# Altium project PPC_notebook_electrical_schematics_v0.7.PrjPcb (part 10 of 14)

## Sheet 22 MXM_VIDEO_OUT.SchDoc
size 420 x 297 mm
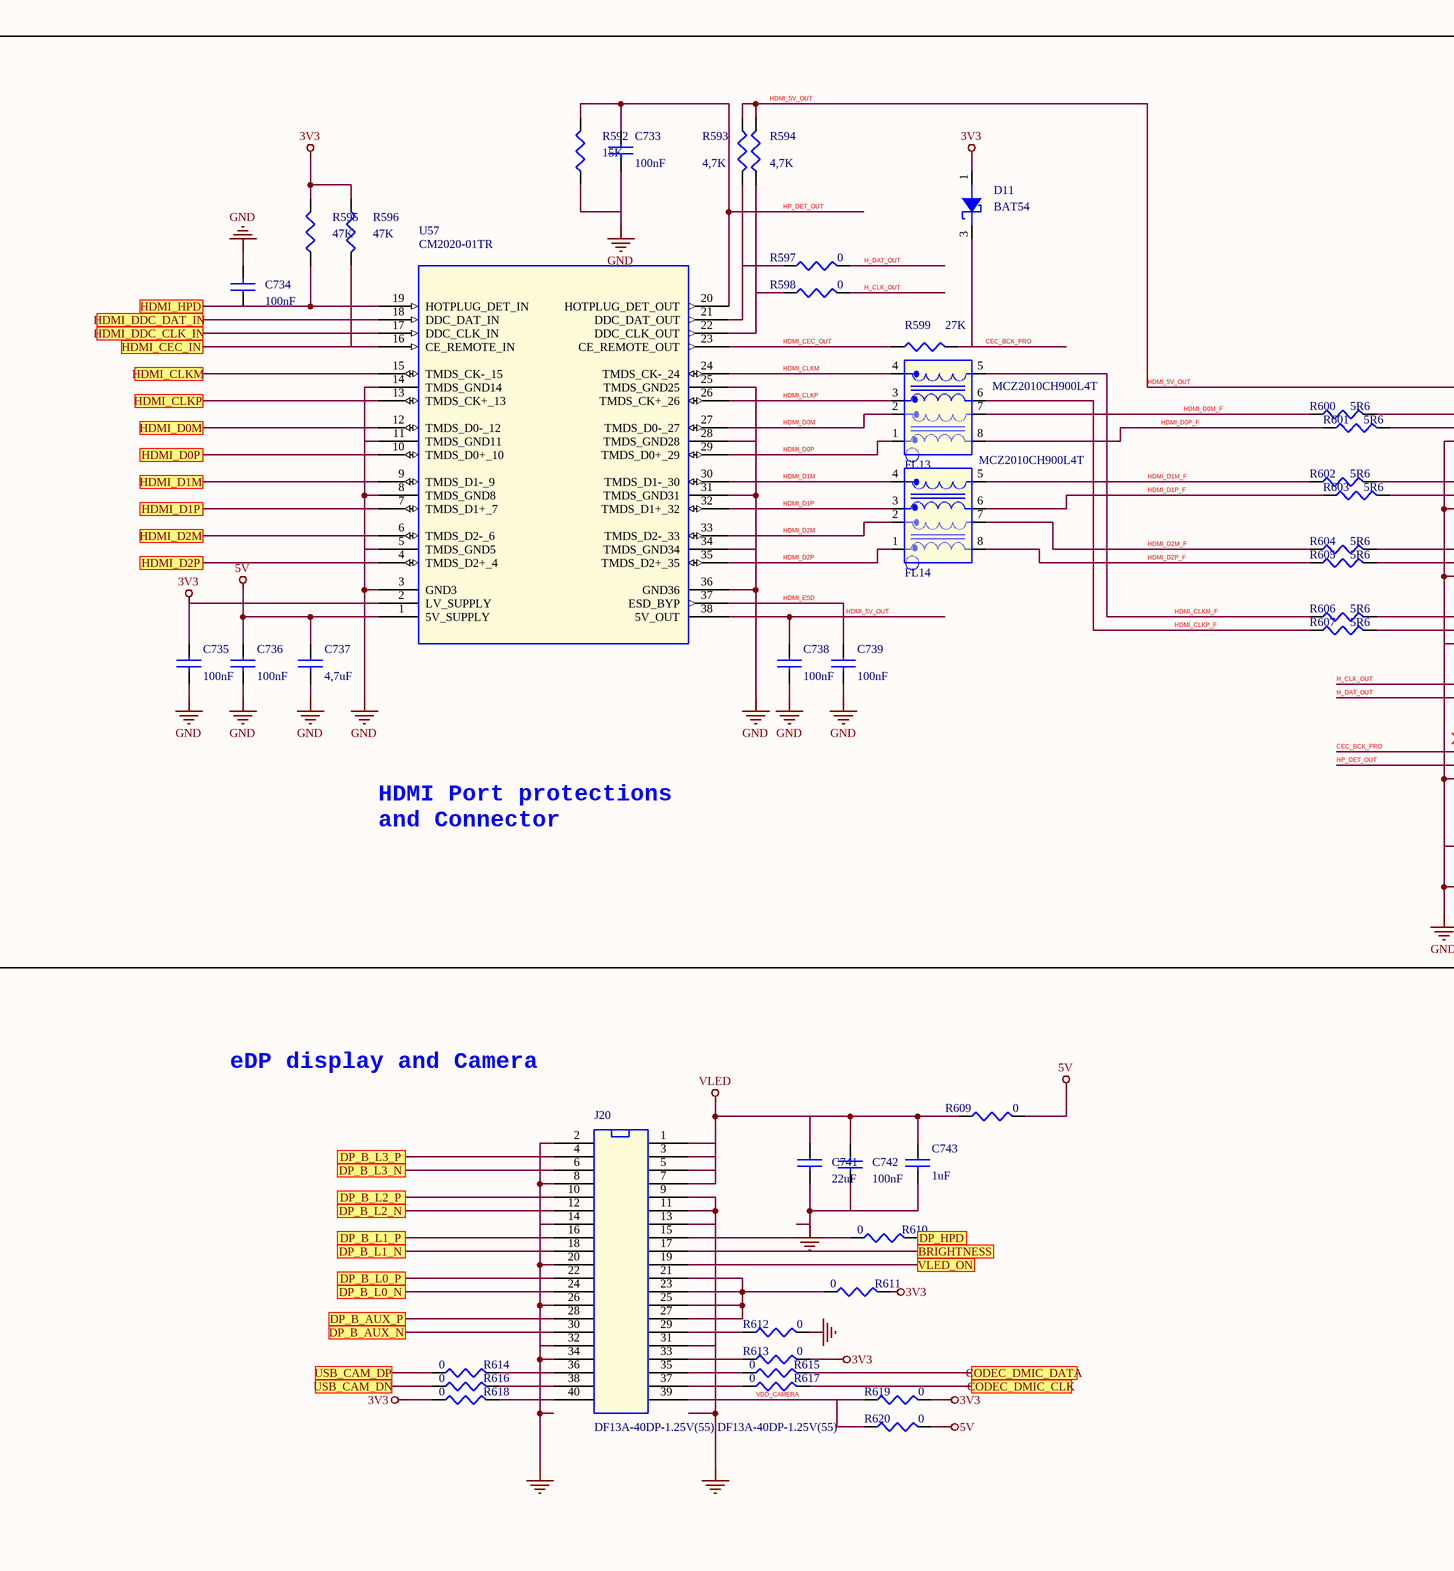
[diagram p50: 22 MXM_VIDEO_OUT.SchDoc, left]
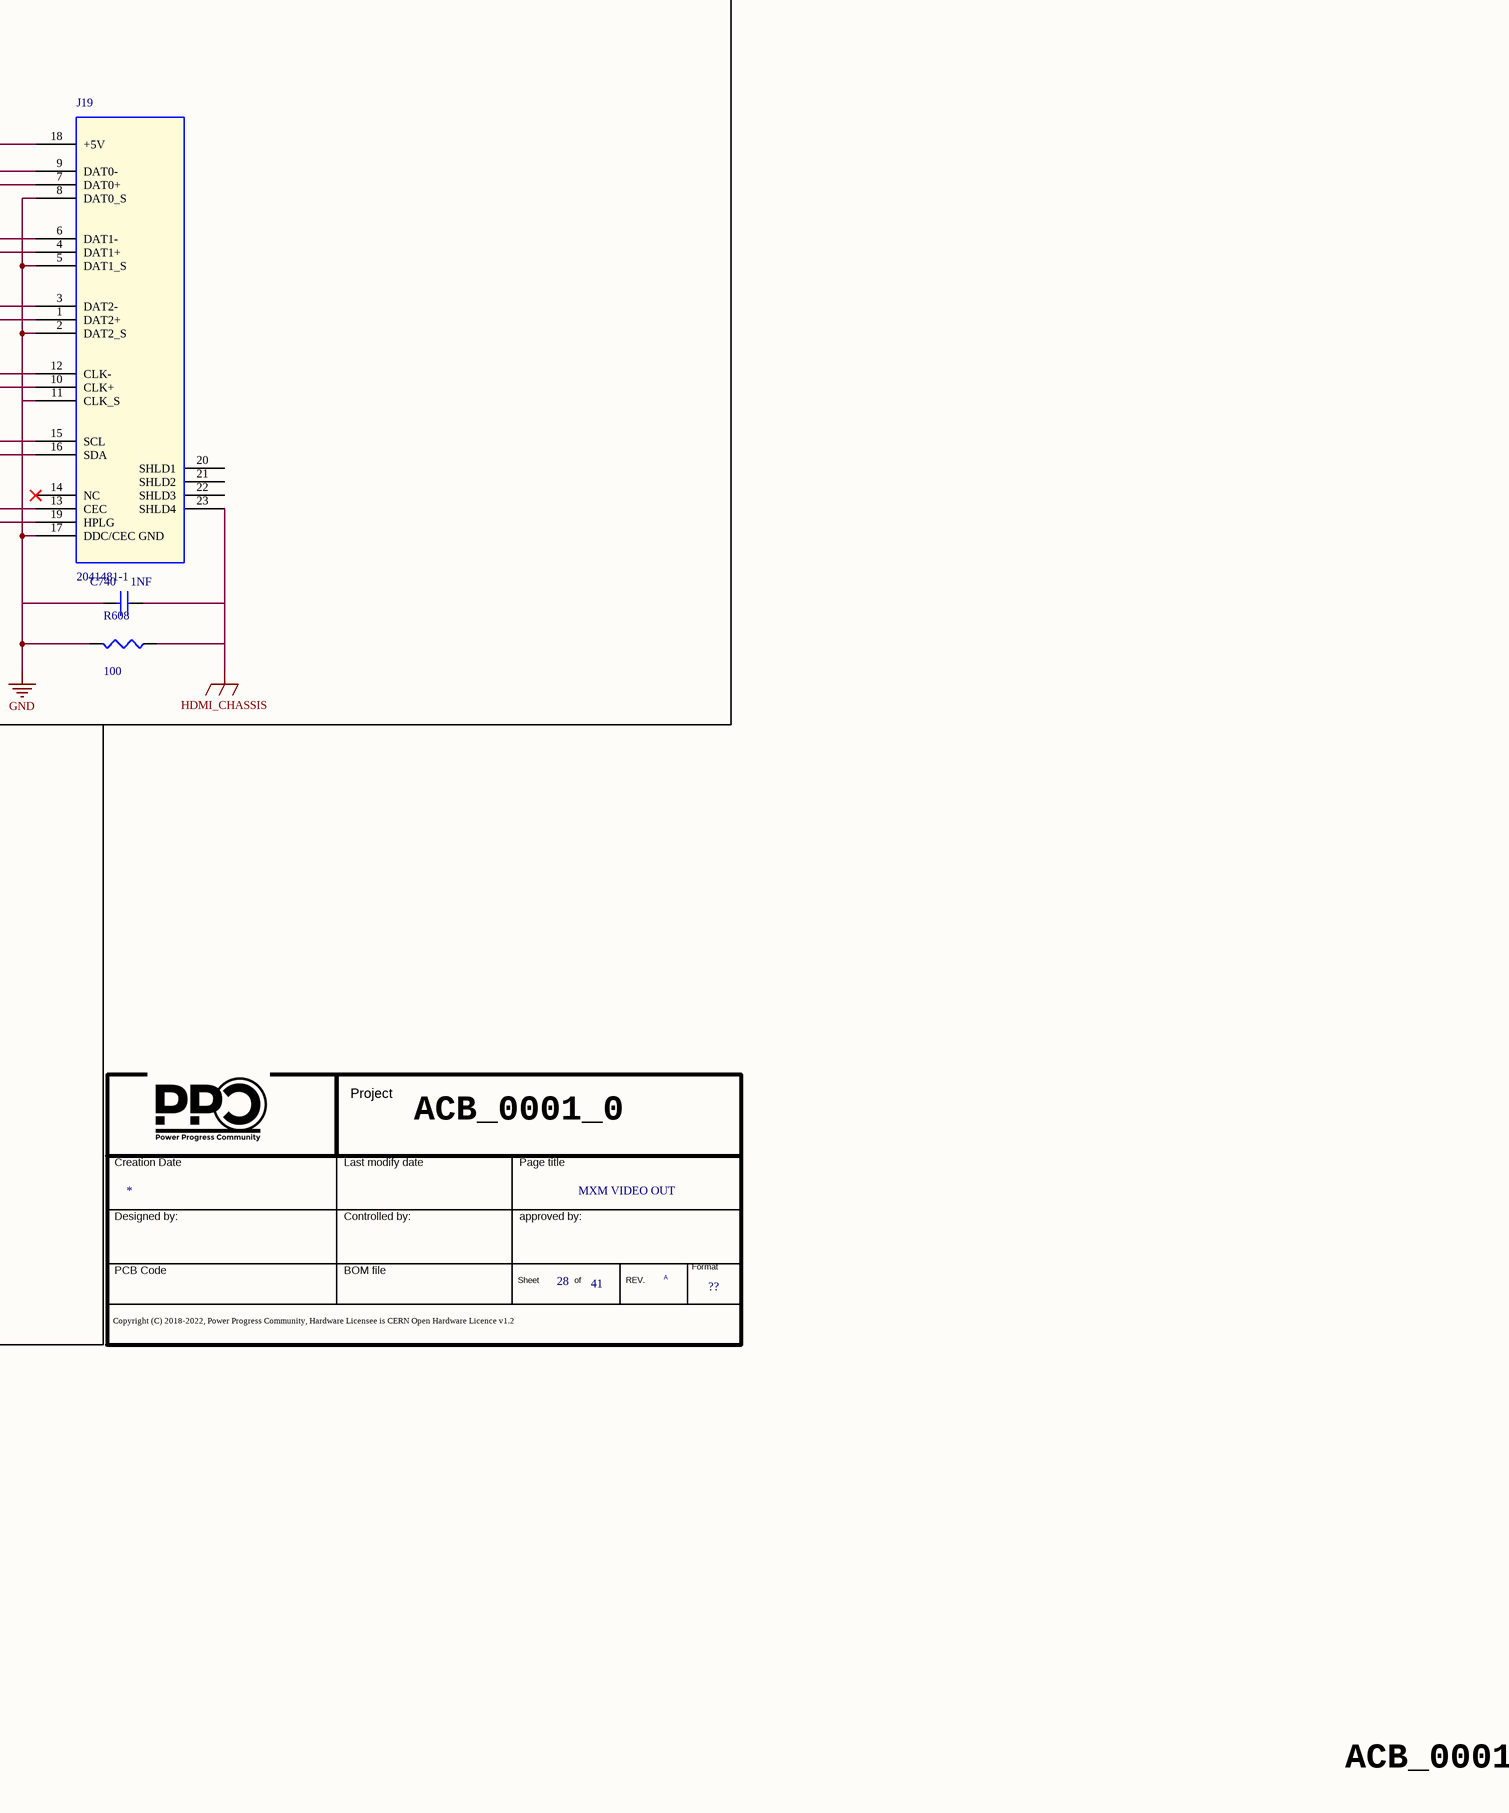
[diagram p51: 22 MXM_VIDEO_OUT.SchDoc, right]

### Parts
(Parts that share a designator on the sheet are numbered #1, #2 ... from top to bottom, then left to right.)
*#31  Doc: MXM VIDEO OUT  Page Count: 41  Page Number: 28  Page Size: ??  RevCode: A  (hidden comment: Title_block_PPC)  (graphical)
C733  100nF  [SMD_0402]
C734  100nF  [SMD_0402]
C735  100nF  [SMD_0402]
C736  100nF  [SMD_0402]
C737  4,7uF  [SMD_0603]
C738  100nF  [SMD_0402]
C739  100nF  [SMD_0402]
C740  1NF  [SMD_1808]
C741  22uF  [SMD_0805]
C742  100nF  [SMD_0402]
C743  1uF  [SMD_0402]
D11  BAT54  [SOT-23]
FL13  MCZ2010CH900L4T  [SMD]
FL14  MCZ2010CH900L4T  [SMD]
J19  2041481-1  [19 PIN SMD]
J20  DF13A-40DP-1.25V(55) / DF13A-40DP-1.25V(55)  [SMD_2X50_P=0.635mm]
R592  15K  [SMD_0402]
R593  4,7K  [SMD_0402]
R594  4,7K  [SMD_0402]
R595  47K  [SMD_0402]
R596  47K  [SMD_0402]
R597  0  [SMD_0402]
R598  0  [SMD_0402]
R599  27K  [SMD_0402]
R600  5R6  [SMD_0402]
R601  5R6  [SMD_0402]
R602  5R6  [SMD_0402]
R603  5R6  [SMD_0402]
R604  5R6  [SMD_0402]
R605  5R6  [SMD_0402]
R606  5R6  [SMD_0402]
R607  5R6  [SMD_0402]
R608  100  [SMD_0402]
R609  0  [SMD_1206]
R610  0  [SMD_0402]
R611  0  [SMD_0402]
R612  0  [SMD_0402]
R613  0  [SMD_0402]
R614  0  [SMD_0402]
R615  0  [SMD_0402]
R616  0  [SMD_0402]
R617  0  [SMD_0402]
R618  0  [SMD_0402]
R619  0  [SMD_0402]
R620  0  [SMD_0402]
U57  CM2020-01TR  [tssop38]

### Blocks framed on the sheet
eDP display and Camera: C741-C743 J20 R609-R620

### Ports
BRIGHTNESS, CODEC_DMIC_CLK, CODEC_DMIC_DATA, DP_B_AUX_N, DP_B_AUX_P, DP_B_L0_N, DP_B_L0_P, DP_B_L1_N, DP_B_L1_P, DP_B_L2_N, DP_B_L2_P, DP_B_L3_N, DP_B_L3_P, DP_HPD, HDMI_CEC_IN, HDMI_CLKM, HDMI_CLKP, HDMI_D0M, HDMI_D0P, HDMI_D1M, HDMI_D1P, HDMI_D2M, HDMI_D2P, HDMI_DDC_CLK_IN, HDMI_DDC_DAT_IN, HDMI_HPD, USB_CAM_DN, USB_CAM_DP, VLED_ON

### Nets
3V3: C735.1 D11.1(ANODE) R595.1 R596.1 R611.1 R613.2 R618.2 R619.2 U57.2(LV_SUPPLY)
5V: C736.1 C737.1 R609.2 R620.2 U57.1(5V_SUPPLY)
GND: C733.2 C734.2 C735.2 C736.2 C737.2 C738.2 C739.2 C740.2 C741.2 C742.1 C743.2 J19.2(DAT2_S) J19.5(DAT1_S) J19.8(DAT0_S) J19.11(CLK_S) J19.17(DDC/CEC_GND) J20.2 J20.8 J20.9 J20.11 J20.13 J20.14 J20.20 J20.26 J20.31 J20.32 J20.34 R592.2 R608.2 R612.2 U57.3(GND3) U57.5(TMDS_GND5) U57.8(TMDS_GND8) U57.11(TMDS_GND11) U57.14(TMDS_GND14) U57.25(TMDS_GND25) U57.28(TMDS_GND28) U57.31(TMDS_GND31) U57.34(TMDS_GND34) U57.36(GND36)
HDMI_CHASSIS: C740.1 J19.23(SHLD4) R608.1
VLED: C741.1 C742.2 C743.1 J20.1 J20.3 J20.5 J20.7 R609.1
CEC_BCK_PRO: D11.3(CATHODE) J19.13(CEC) R599.2
H_CLK_OUT: J19.15(SCL) R598.2
H_DAT_OUT: J19.16(SDA) R597.2
HDMI_5V_OUT: C738.1 J19.18(+5V) R593.2 R594.2 U57.38(5V_OUT)
HDMI_CEC_OUT: R599.1 U57.23(CE_REMOTE_OUT)
HDMI_CLKM: FL13.4 U57.24(TMDS_CK-_24)
HDMI_CLKM_F: FL13.5 R606.1
HDMI_CLKP: FL13.3 U57.26(TMDS_CK+_26)
HDMI_CLKP_F: FL13.6 R607.1
HDMI_D0M: FL13.2 U57.27(TMDS_D0-_27)
HDMI_D0M_F: FL13.7 R600.1
HDMI_D0P: FL13.1 U57.29(TMDS_D0+_29)
HDMI_D0P_F: FL13.8 R601.1
HDMI_D1M: FL14.4 U57.30(TMDS_D1-_30)
HDMI_D1M_F: FL14.5 R602.1
HDMI_D1P: FL14.3 U57.32(TMDS_D1+_32)
HDMI_D1P_F: FL14.6 R603.1
HDMI_D2M: FL14.2 U57.33(TMDS_D2-_33)
HDMI_D2M_F: FL14.7 R604.1
HDMI_D2P: FL14.1 U57.35(TMDS_D2+_35)
HDMI_D2P_F: FL14.8 R605.1
HDMI_ESD: C739.1 U57.37(ESD_BYP)
HP_DET_OUT: C733.1 J19.19(HPLG) R592.1 U57.20(HOTPLUG_DET_OUT)
VDD_CAMERA: J20.39 R619.1 R620.1
NetC715_2: J20.24 ; port DP_B_L0_N
NetC716_2: J20.22 ; port DP_B_L0_P
NetC717_2: J20.18 ; port DP_B_L1_N
NetC718_2: J20.16 ; port DP_B_L1_P
NetC719_2: U57.12(TMDS_D0-_12) ; port HDMI_D0M
NetC720_2: U57.10(TMDS_D0+_10) ; port HDMI_D0P
NetC721_2: J20.12 ; port DP_B_L2_N
NetC722_2: J20.10 ; port DP_B_L2_P
NetC723_2: U57.9(TMDS_D1-_9) ; port HDMI_D1M
NetC724_2: U57.7(TMDS_D1+_7) ; port HDMI_D1P
NetC725_2: J20.6 ; port DP_B_L3_N
NetC726_2: J20.4 ; port DP_B_L3_P
NetC727_2: U57.6(TMDS_D2-_6) ; port HDMI_D2M
NetC728_2: U57.4(TMDS_D2+_4) ; port HDMI_D2P
NetC729_2: J20.30 ; port DP_B_AUX_N
NetC730_2: J20.28 ; port DP_B_AUX_P
NetC731_2: U57.15(TMDS_CK-_15) ; port HDMI_CLKM
NetC732_2: U57.13(TMDS_CK+_13) ; port HDMI_CLKP
NetC734_1: C734.1 R595.2 U57.19(HOTPLUG_DET_IN) ; port HDMI_HPD
NetJ18_29: R596.2 U57.16(CE_REMOTE_IN) ; port HDMI_CEC_IN
NetJ18_274: R610.1 ; port DP_HPD
NetJ18_277: U57.18(DDC_DAT_IN) ; port HDMI_DDC_DAT_IN
NetJ18_279: U57.17(DDC_CLK_IN) ; port HDMI_DDC_CLK_IN
NetJ19_1: J19.1(DAT2+) R605.2
NetJ19_3: J19.3(DAT2-) R604.2
NetJ19_4: J19.4(DAT1+) R603.2
NetJ19_6: J19.6(DAT1-) R602.2
NetJ19_7: J19.7(DAT0+) R601.2
NetJ19_9: J19.9(DAT0-) R600.2
NetJ19_10: J19.10(CLK+) R607.2
NetJ19_12: J19.12(CLK-) R606.2
NetJ20_15: J20.15 R610.2
NetJ20_17: J20.17 ; port BRIGHTNESS
NetJ20_19: J20.19 ; port VLED_ON
NetJ20_21: J20.21 J20.23 J20.25 J20.27 R611.2
NetJ20_29: J20.29 R612.1
NetJ20_33: J20.33 R613.1
NetJ20_35: J20.35 R615.2
NetJ20_36: J20.36 R614.1
NetJ20_37: J20.37 R617.2
NetJ20_38: J20.38 R616.1
NetJ20_40: J20.40 R618.1
NetR297_2: R614.2 ; port USB_CAM_DP
NetR300_2: R616.2 ; port USB_CAM_DN
NetR593_1: R593.1 R597.1 U57.21(DDC_DAT_OUT)
NetR594_1: R594.1 R598.1 U57.22(DDC_CLK_OUT)
NetR615_1: R615.1 ; port CODEC_DMIC_DATA
NetR617_1: R617.1 ; port CODEC_DMIC_CLK

Not connected (* = marked no-connect by the designer): J19 14(NC)* 20(SHLD1) 21(SHLD2) 22(SHLD3)

### Notes on the sheet
- HDMI Port protections
  and Connector
- ACB_0001_0

### Library data of the parts
*#31 = Title_block_PPC: Title: T2080PCIe; Author: MICETEK; Page Create Date: March  8, 1995; Page Title: ?; Page Modify Date: *
C733-C735 = CAP NP_Dup6: COND.CER. 100NF 50V 0402 X7R SMD; Part Number: PASSIVE_24; Manufacturer 1: TDK; Manufacturer Part Number 1: CGA2B3X7R1H104M050BD; TECNO77: C0402; RSM: RC0402; Part Type: Capacitors\Ceramic\SMD\0402; Distributor 1: MURATA ELETTRONICA SPA; PCB Footprint: SMD_0402
C736 = CAP NP_Dup6: COND.CER. 100NF 50V 0402 X7R SMD; Manufacturer Part Number 1: CGA2B3X7R1H104M050BD; Manufacturer 1: TDK; Part Number: PASSIVE_24; TECNO77: C0402; RSM: RC0402; Distributor 1: MURATA ELETTRONICA SPA; Part Type: Capacitors\Ceramic\SMD\0402; PCB Footprint: SMD_0402
C737 = CAP NP_Dup6: COND.CER.4,7uF 16V X5R 0603 SMD; Part Number: PASSIVE_1405; Manufacturer 1: SAMSUNG; Manufacturer Part Number 1: CL10A475KO8NNNC; TECNO77: C0603; RSM: RC0603; Part Type: Capacitors\Ceramic\SMD\0603; Distributor 1: DIGIKEY (490-3302-1-ND); PCB Footprint: SMD_0603
C738 = CAP NP_Dup6: COND.CER. 100NF 50V 0402 X7R SMD; Part Number: PASSIVE_24; Manufacturer 1: TDK; Manufacturer Part Number 1: CGA2B3X7R1H104M050BD; RSM: RC0402; TECNO77: C0402; PCB Footprint: SMD_0402; Part Type: Capacitors\Ceramic\SMD\0402; Distributor 1: MURATA ELETTRONICA SPA
C739 = CAP NP_Dup6: COND.CER. 100NF 50V 0402 X7R SMD; Manufacturer Part Number 1: CGA2B3X7R1H104M050BD; Manufacturer 1: TDK; Part Number: PASSIVE_24; RSM: RC0402; TECNO77: C0402; PCB Footprint: SMD_0402; Distributor 1: MURATA ELETTRONICA SPA; Part Type: Capacitors\Ceramic\SMD\0402
C740 = CAP NP_Dup6: CAP CER 1000PF 2KV 20% X7R 1808; Manufacturer Part Number 1: 1808GC102MAT1A; Manufacturer 1: AVX; Part Number: PASSIVE_280; RSM: RC1808; TECNO77: C1210; PCB Footprint: SMD_1808; Distributor 1: DIGIKEY(709-1040-1-ND); Part Type: Capacitors\Ceramic\SMD\1808
C741 = CAP NP_Dup3: 22UF 35V 20% 0805; Manufacturer Part Number 1: C2012X5R1V226M125AC; Manufacturer 1: TDK; Part Number: PASSIVE_224; RSM: RC0805; PCB Footprint: SMD_0805; Part Type: Capacitors\Ceramic\SMD\0805
C742 = CAP NP_Dup10: COND.CER. 100NF 50V 0402 X7R SMD; Manufacturer Part Number 1: CGA2B3X7R1H104M050BD; Manufacturer 1: TDK; Part Number: PASSIVE_24; RSM: RC0402; Distributor 1: MURATA ELETTRONICA SPA; Part Type: Capacitors\Ceramic\SMD\0402; PCB Footprint: SMD_0402
C743 = CAP NP_Dup10: CAP CER 1UF 6.3V 10% X5R 0402 AUTOMOTIVE; Part Number: PASSIVE_49; Manufacturer 1: Taiyo Yuden; Manufacturer Part Number 1: JMK105BJ105KVHF; RSM: RC0402; Part Type: Capacitors\Ceramic\SMD\0402; Distributor 1: DIGIKEY (587-3766-1-ND); PCB Footprint: SMD_0402
D11 = diode_schottky_SOT23_Dup1: DIODE SCHOTTKY 30V 200MA SOT-23; Part Number: DISCRETE_84; Manufacturer 1: ZETEX; TECNO77: SOT23_P321; Part Type: Diodes\SCHOTTKY; Manufacturer Part Number 1: BAT54; Distributor 1: FARNELL (1467516); PCB Footprint: SOT-23; RSM: SOT-23
FL13 FL14 = CHOKE_HS_DUAL: CHOKE COMM MODE 90 OHM SMD HDMI; Part Number: PASSIVE_353; Manufacturer 1: TDK; RSM: EMI-MCZ2010CH; PCB Footprint: SMD; Part Type: Inductors\SMD\CM Choke; Manufacturer Part Number 1: MCZ2010CH900L4T
J19 = CONN_HDMI: HDMI TYPE A RECEPT RA SMD OFFSET CONN; Manufacturer 1: TE; Part Number: CONNECTORS_706; RSM: TE-HDMI-571-2041481-1; PCB Footprint: 19 PIN SMD; Distributor 1: MOUSER (571-2041481-1); Manufacturer Part Number 1: 2041481-1; Part Type: VPORT\HDMI
J20 = HEADER_20X2: Terminali e capicorda 1.25MM V PIN HEADER 40P SMT; PART NUMBER: CONNECTORS_135; Manufacturer 1: HIROSE; RSM: HIROSE-DF13A-40DP-1_25; PCB Footprint: SMD 2X20 P_125MM; Distributor 1: DIGIKEY(H10166-ND); Manufacturer Part Number 1: DF13A-40DP-1.25V(55) / DF13A-40DP-1.25V(55); Part Type: DF13
R592 = R_Dup6: RESIS.CHIP 15K 1% 0402 SMD; Manufacturer 1: ROYAL OHM; Part Number: PASSIVE_614; RSM: RC0402; Manufacturer Part Number 1: RESIS.CHIP 15K 1% 0402 SMD; PCB Footprint: SMD_0402; Part Type: Resistors\Fixed\SMD\0402\1%
R593 R594 = R_Dup8: RESIS.CHIP 4,7K 5% 0402 SMD; Manufacturer 1: ROYAL OHM; Part Number: PASSIVE_861; TECNO77: R0402; RSM: RC0402; Distributor 1: CAMEL ELETTRONICA SRL  #; Manufacturer Part Number 1: RESIS.CHIP 4,7K 5% 0402 SMD; Part Type: Resistors\Fixed\SMD\0402\5%; PCB Footprint: SMD_0402
R595 R596 = R_Dup6: RESIS.CHIP 47K 1% 0402 SMD; Part Number: PASSIVE_737; Manufacturer 1: ROYAL OHM; RSM: RC0402; Part Type: Resistors\Fixed\SMD\0402\1%; PCB Footprint: SMD_0402; Manufacturer Part Number 1: RESIS.CHIP 47K 1% 0402 SMD
R597 R598 = R_Dup8: RESIS.CHIP 0R 5% 0402 SMD; Manufacturer 1: ROYAL OHM; Part Number: PASSIVE_805; TECNO77: R0402; RSM: RC0402; Distributor 1: CAMEL ELETTRONICA SRL  #; Manufacturer Part Number 1: RESIS.CHIP 0R 5% 0402 SMD; Part Type: Resistors\Fixed\SMD\0402\5%; PCB Footprint: SMD_0402
R599 = R_Dup8: RESIS.CHIP 27K 1% 0402 SMD; Manufacturer 1: ROYAL OHM; Part Number: PASSIVE_664; RSM: RC0402; TECNO77: R0402; Distributor 1: CAMEL ELETTRONICA SRL  #; Manufacturer Part Number 1: RESIS.CHIP 27K 1% 0402 SMD; Part Type: Resistors\Fixed\SMD\0402\1%; PCB Footprint: SMD_0402
R600 R601 R605 = R_Dup6: RESIS.CHIP 5.6 ohm 5% 0402 SMD; Part Number: PASSIVE_1423; Manufacturer 1: YAGEO; Manufacturer Part Number 1: RC0402JR-075R6L; RSM: RC0402; Part Type: Resistors\Fixed\SMD\0402\5%; Distributor 1: DIGIKEY(311-5.6JRDKR-ND); PCB Footprint: SMD_0402
R602-R604 R606 R607 = R_Dup6: RESIS.CHIP 5.6 ohm 5% 0402 SMD; Manufacturer Part Number 1: RC0402JR-075R6L; Manufacturer 1: YAGEO; Part Number: PASSIVE_1423; RSM: RC0402; Distributor 1: DIGIKEY(311-5.6JRDKR-ND); Part Type: Resistors\Fixed\SMD\0402\5%; PCB Footprint: SMD_0402
R608 = R_Dup6: RESIS.CHIP 100R 5% 0402 SMD; Manufacturer 1: ROYAL OHM; Part Number: PASSIVE_812; RSM: RC0402; Manufacturer Part Number 1: RESIS.CHIP 100R 5% 0402 SMD; PCB Footprint: SMD_0402; Part Type: Resistors\Fixed\SMD\0402\5%
R609 = R_Dup6: RESIS. 0R 1/4W 1206 SMD E96; Part Number: PASSIVE_1266; Manufacturer 1: ASJ; Manufacturer Part Number 1: CR32000ZL; RSM: RC1206; Part Type: Resistors\Fixed\SMD\1206\5%; Distributor 1: TTI ITALY SRL; PCB Footprint: SMD_1206
R610 = R_Dup6: RESIS.CHIP 0R 5% 0402 SMD; Manufacturer 1: ROYAL OHM; Part Number: PASSIVE_805; RSM: RC1206; Distributor 1: CAMEL ELETTRONICA SRL  #; Manufacturer Part Number 1: RESIS.CHIP 0R 5% 0402 SMD; Part Type: Resistors\Fixed\SMD\0402\5%; PCB Footprint: SMD_0402
R611 R614-R617 R620 = R_Dup6: RESIS.CHIP 0R 5% 0402 SMD; Manufacturer 1: ROYAL OHM; Part Number: PASSIVE_805; RSM: RC0402; Distributor 1: CAMEL ELETTRONICA SRL  #; Manufacturer Part Number 1: RESIS.CHIP 0R 5% 0402 SMD; Part Type: Resistors\Fixed\SMD\0402\5%; PCB Footprint: SMD_0402
R612 R613 R618 R619 = R_Dup6: RESIS.CHIP 0R 5% 0402 SMD; Part Number: PASSIVE_805; Manufacturer 1: ROYAL OHM; RSM: RC0402; Part Type: Resistors\Fixed\SMD\0402\5%; Manufacturer Part Number 1: RESIS.CHIP 0R 5% 0402 SMD; Distributor 1: CAMEL ELETTRONICA SRL  #; PCB Footprint: SMD_0402
U57 = CM2020_TSSOP_38P: IC XMTR HDMI ESD PROTECTION 5V TSSOP38; Part Number: LOGIC_105; Manufacturer 1: ON Semi; RSM: TSSOP-38; TECNO77: TSSOP38P0.5; CAD_APPROVED: Yes; MFG_NAME01: ON SEMICONDUCTOR; AGILE_PN: 312-80388; CLASS: IC; Part Type: HDMI\TRANSMITTER; Distributor 1: DIGIKEY(CM2020-01TROSCT-ND); Manufacturer Part Number 1: CM2020-01TR; HEIGHT: 1.2MM; ROHS: Yes; MFG_PN01: CM2020-01TR; PCB Footprint: tssop38

## Sheet 23 I2C WRAP.SchDoc
size 297 x 209 mm
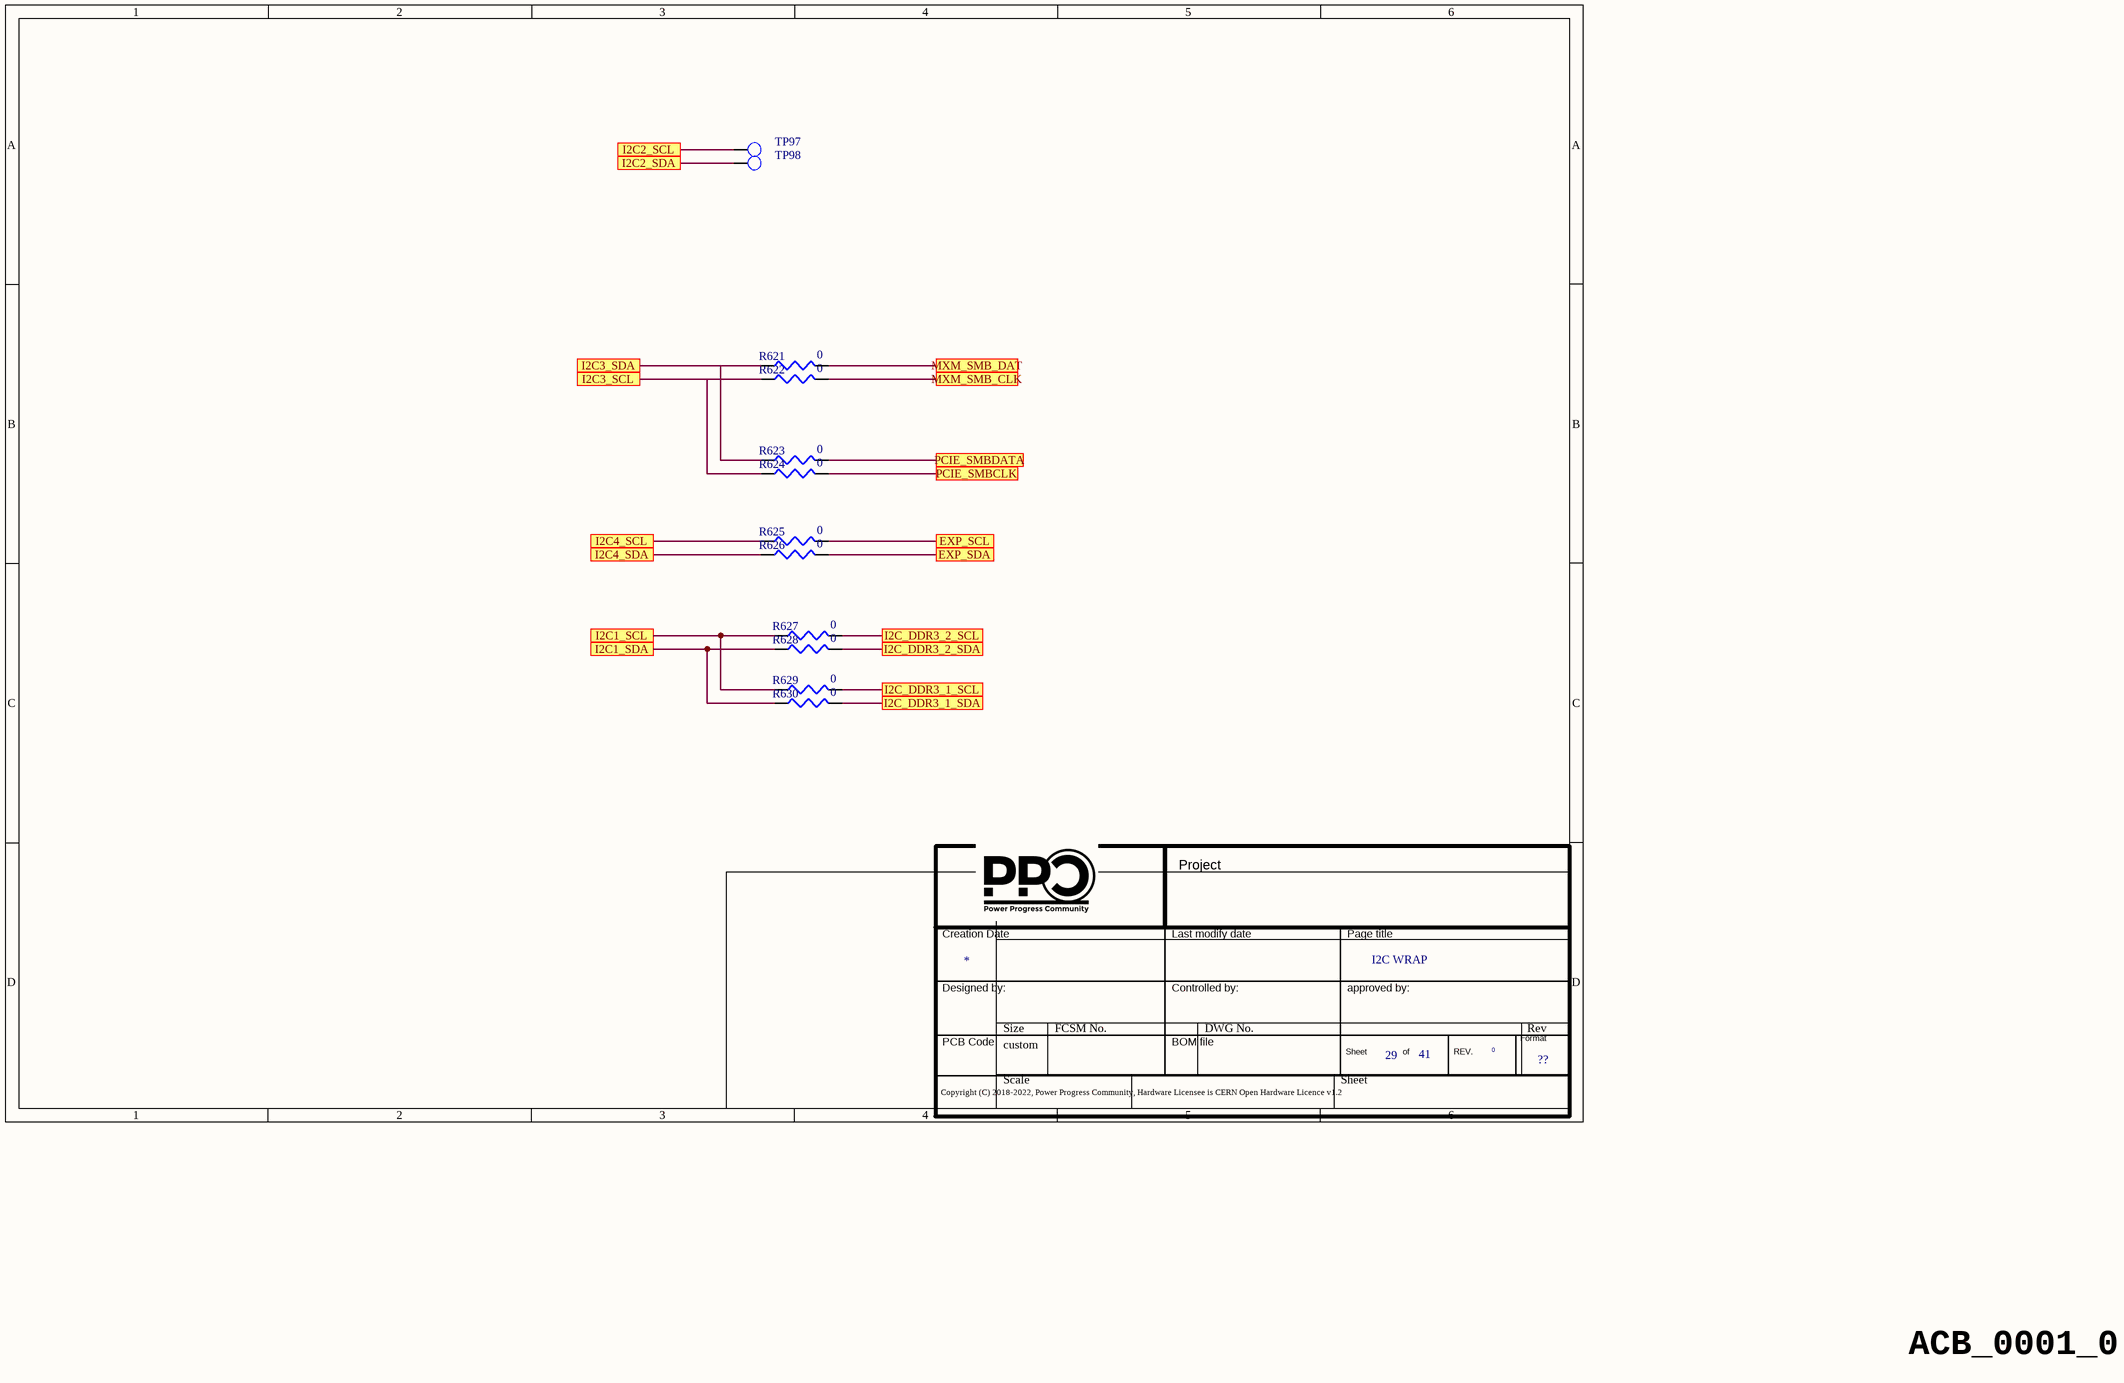
[diagram p52: 23 I2C WRAP.SchDoc]

### Parts
(Parts that share a designator on the sheet are numbered #1, #2 ... from top to bottom, then left to right.)
*#32  Doc: I2C WRAP  Page Count: 41  Page Number: 29  Page Size: ??  RevCode: 0  (hidden comment: Title_block_PPC)  (graphical)
R621  0  [SMD_0402]
R622  0  [SMD_0402]
R623  0  [SMD_0402]
R624  0  [SMD_0402]
R625  0  [SMD_0402]
R626  0  [SMD_0402]
R627  0  [SMD_0402]
R628  0  [SMD_0402]
R629  0  [SMD_0402]
R630  0  [SMD_0402]
TP97  TEST POINT  [PCB]  (value not drawn)
TP98  TEST POINT  [PCB]  (value not drawn)

### Ports
EXP_SCL, EXP_SDA, I2C1_SCL, I2C1_SDA, I2C2_SCL, I2C2_SDA, I2C3_SCL, I2C3_SDA, I2C4_SCL, I2C4_SDA, I2C_DDR3_1_SCL, I2C_DDR3_1_SDA, I2C_DDR3_2_SCL, I2C_DDR3_2_SDA, MXM_SMB_CLK, MXM_SMB_DAT, PCIE_SMBCLK, PCIE_SMBDATA

### Nets
EXP_SCL: R625.2 ; port EXP_SCL
EXP_SDA: R626.2 ; port EXP_SDA
SMBCLK: R624.2 ; port PCIE_SMBCLK
SMBDATA: R623.2 ; port PCIE_SMBDATA
NetJ3F1_200: R630.2 ; port I2C_DDR3_1_SDA
NetJ3F1_202: R629.2 ; port I2C_DDR3_1_SCL
NetJ3F2_200: R628.2 ; port I2C_DDR3_2_SDA
NetJ3F2_202: R627.2 ; port I2C_DDR3_2_SCL
NetR108_1: R628.1 R630.1 ; port I2C1_SDA
NetR109_1: R627.1 R629.1 ; port I2C1_SCL
NetR120_1: TP98.1(TP) ; port I2C2_SDA
NetR121_1: TP97.1(TP) ; port I2C2_SCL
NetR126_1: R621.1 R623.1 ; port I2C3_SDA
NetR127_1: R622.1 R624.1 ; port I2C3_SCL
NetR129_2: R625.1 ; port I2C4_SCL
NetR130_2: R626.1 ; port I2C4_SDA
NetR576_1: R622.2 ; port MXM_SMB_CLK
NetR583_2: R621.2 ; port MXM_SMB_DAT

### Notes on the sheet
- ACB_0001_0

### Library data of the parts
*#32 = Title_block_PPC: Title: T2080PCIe; Author: MICETEK; Page Create Date: March  8, 1995; Page Title: ?; Page Modify Date: *
R621 R622 R624-R626 = R_Dup6: as R612 on sheet 22 MXM_VIDEO_OUT; Part Type: Resistors\Fixed\SMD\0402\5%; Manufacturer Part Number 1: RESIS.CHIP 0R 5% 0402 SMD; Distributor 1: CAMEL ELETTRONICA SRL  #; PCB Footprint: SMD_0402
R623 R627-R630 = R_Dup6: as R611 on sheet 22 MXM_VIDEO_OUT; Distributor 1: CAMEL ELETTRONICA SRL  #; Manufacturer Part Number 1: RESIS.CHIP 0R 5% 0402 SMD; Part Type: Resistors\Fixed\SMD\0402\5%; PCB Footprint: SMD_0402
TP97 TP98 = T POINT R: TEST POINT SU PCB; Part Number: CONNECTORS_542; RSM: AE-TESTPOINT; PCB Footprint: PCB; Part Type: Tpoint

## Sheet 24 AUDIO CMEDIA.SchDoc
size 594 x 420 mm
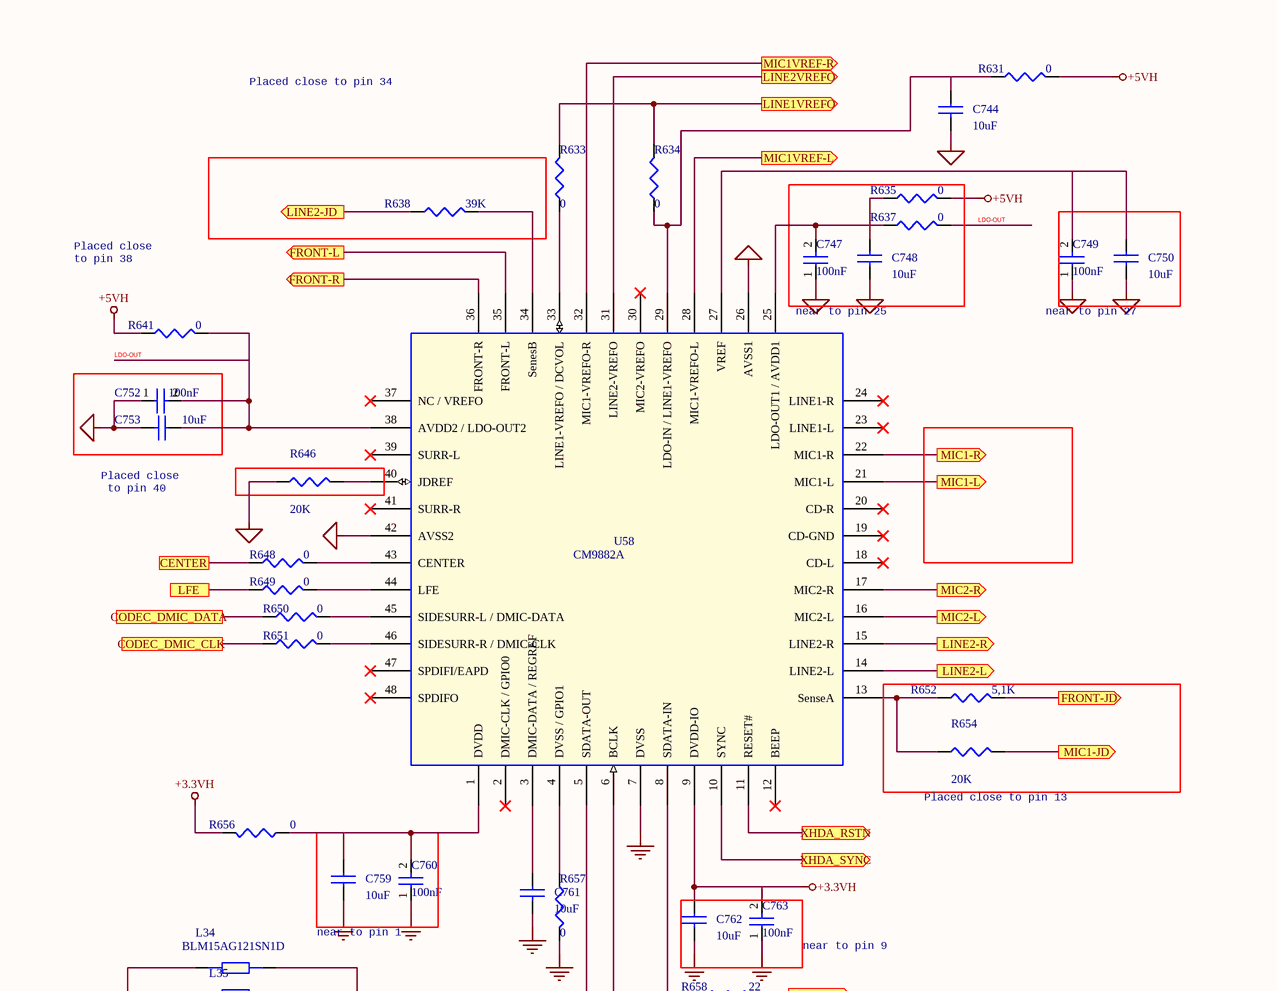
[diagram p53: 24 AUDIO CMEDIA.SchDoc, top left]
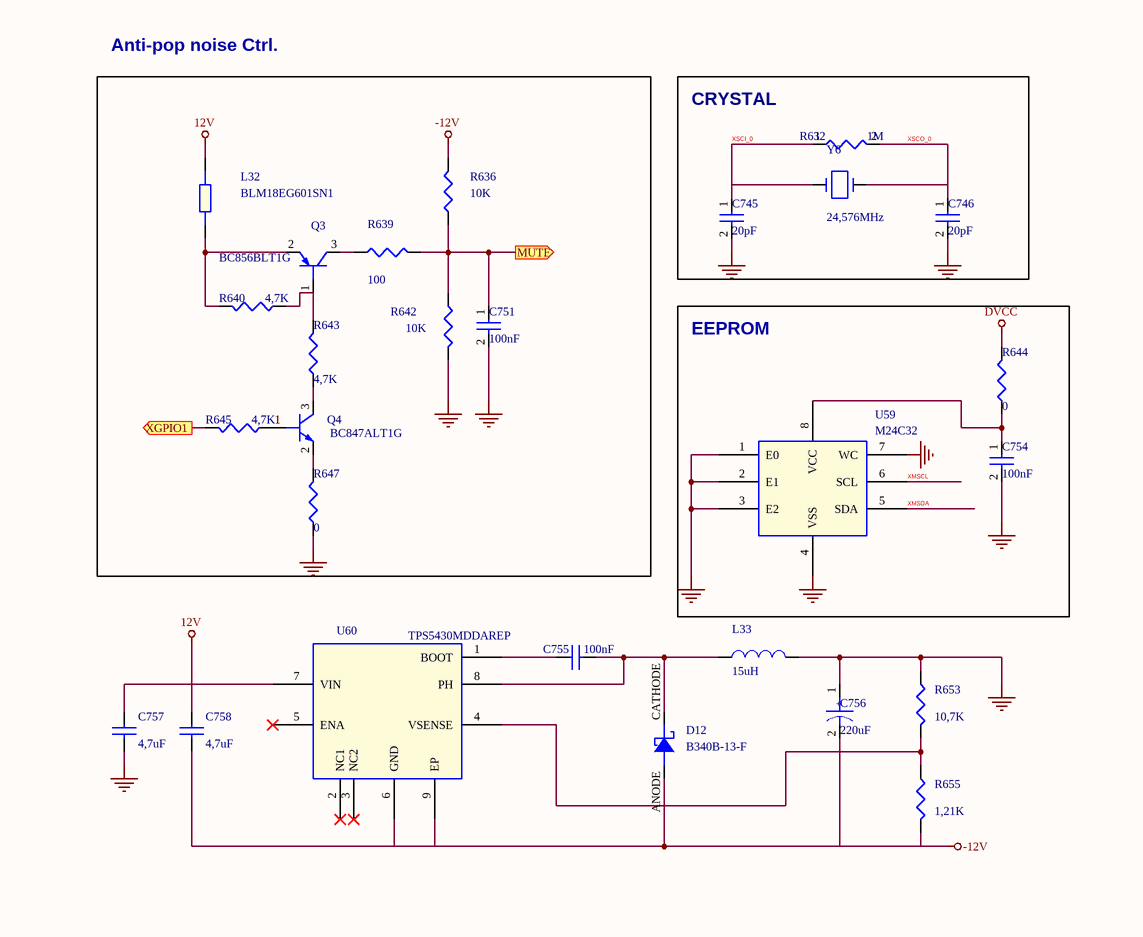
[diagram p54: 24 AUDIO CMEDIA.SchDoc, top right]
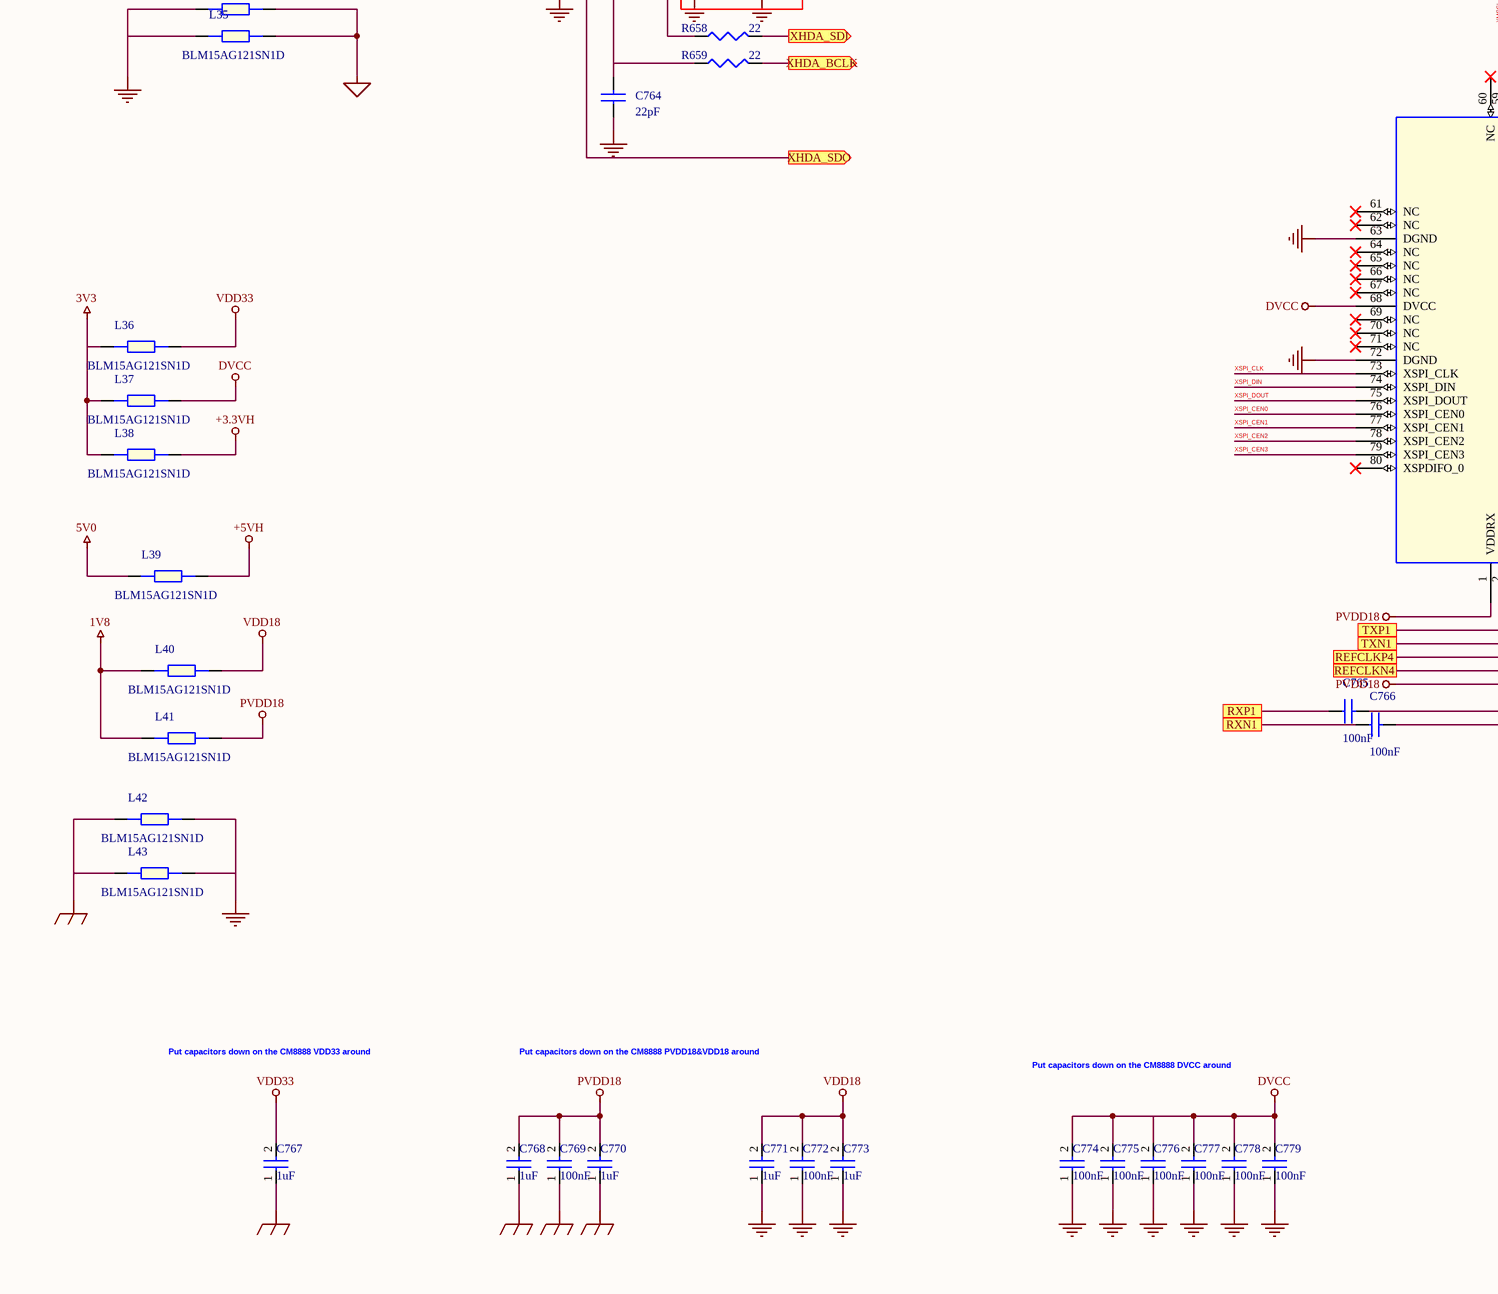
[diagram p55: 24 AUDIO CMEDIA.SchDoc, bottom left]
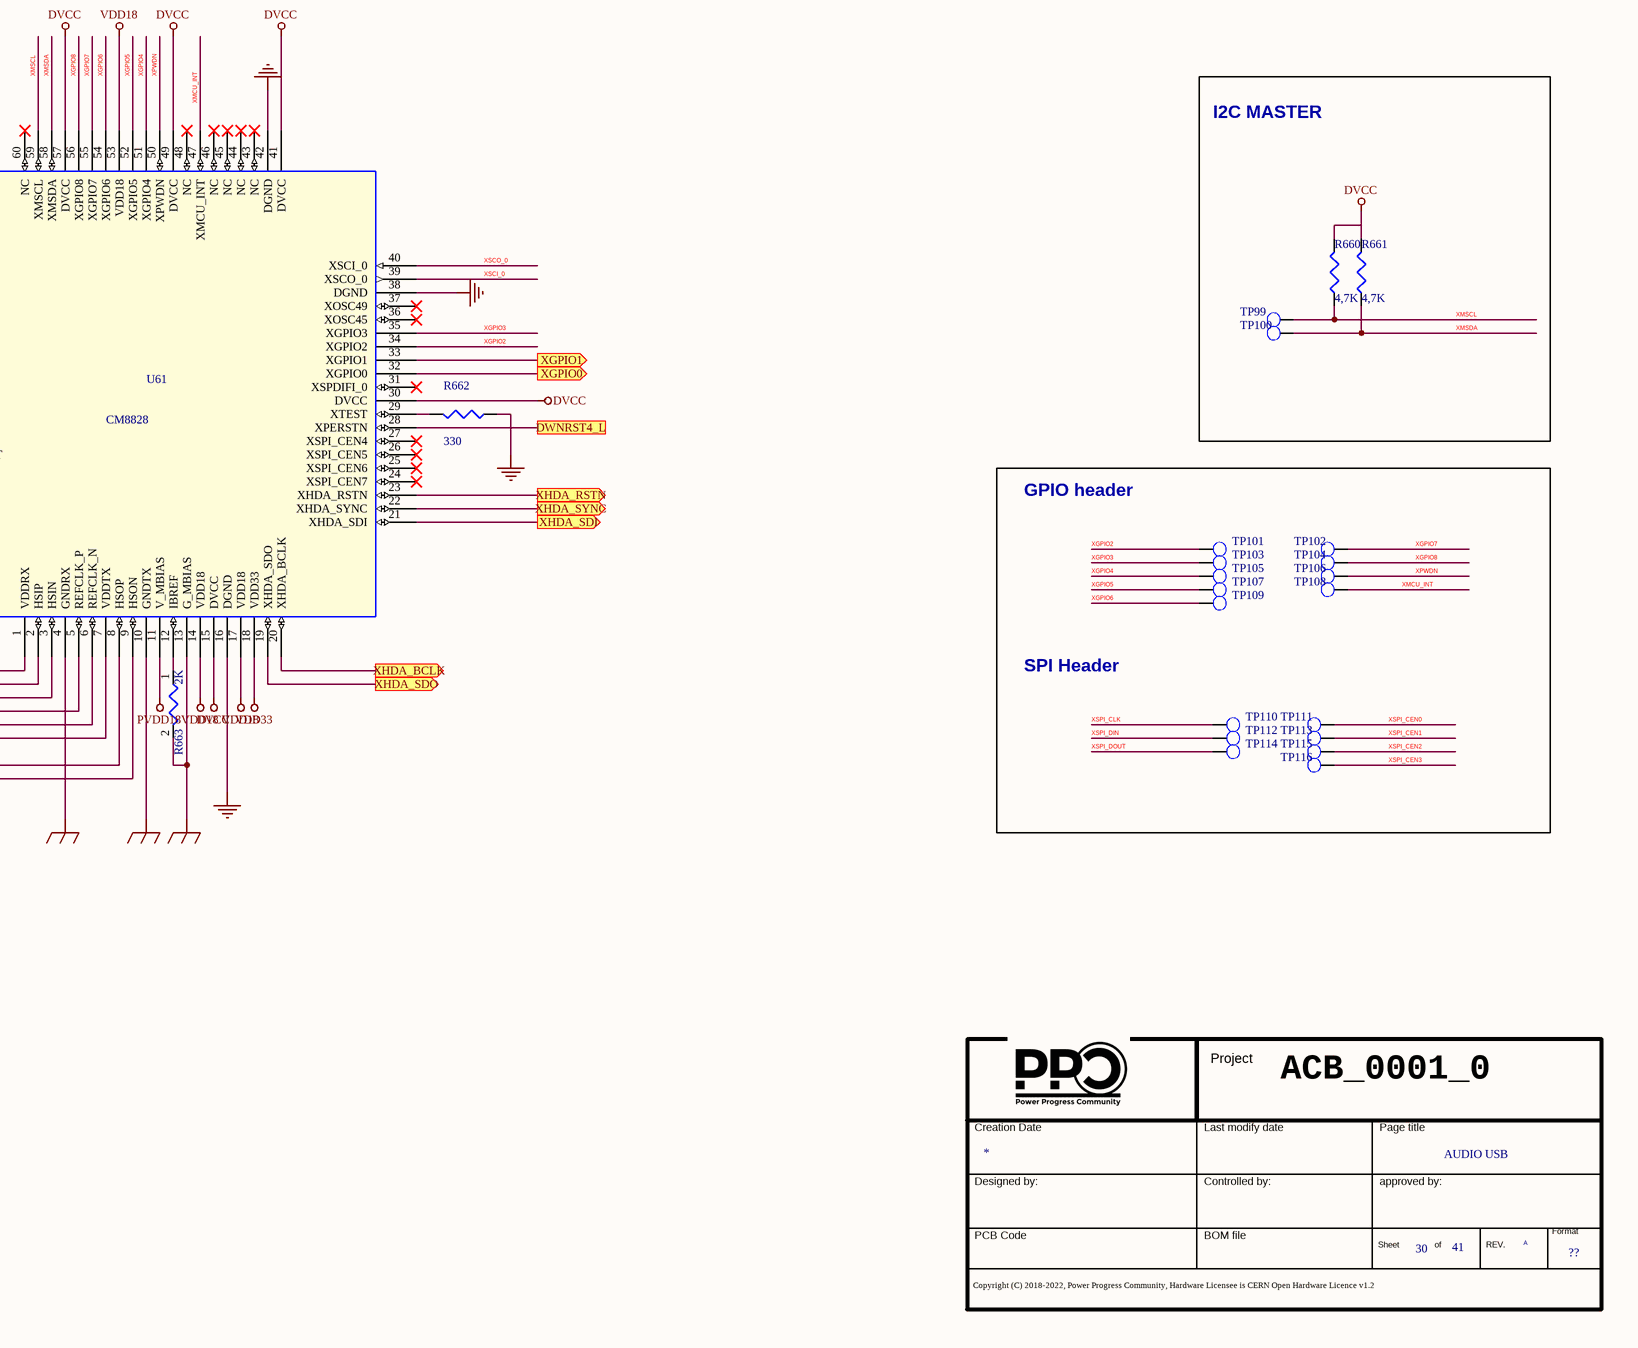
[diagram p56: 24 AUDIO CMEDIA.SchDoc, bottom right]

### Parts
(Parts that share a designator on the sheet are numbered #1, #2 ... from top to bottom, then left to right.)
*#33  Doc: AUDIO USB  Page Count: 41  Page Number: 30  Page Size: ??  RevCode: A  (hidden comment: Title_block_PPC)  (graphical)
C744  10uF  [SMD_0805]
C745  20pF  [SMD_0402]
C746  20pF  [SMD_0402]
C747  100nF  [SMD_0402]
C748  10uF  [SMD_0603]
C749  100nF  [SMD_0402]
C750  10uF  [SMD_0603]
C751  100nF  [SMD_0402]
C752  100nF  [SMD_0402]
C753  10uF  [SMD_0603]
C754  100nF  [SMD_0402]
C755  100nF  [SMD_0402]
C756  220uF  [SMD_CASE_D]
C757  4,7uF  [SMD_0603]
C758  4,7uF  [SMD_0603]
C759  10uF  [SMD_0603]
C760  100nF  [SMD_0402]
C761  10uF  [SMD_0805]
C762  10uF  [SMD_0603]
C763  100nF  [SMD_0402]
C764  22pF  [SMD_0402]
C765  100nF  [SMD_0402]
C766  100nF  [SMD_0402]
C767  1uF  [SMD_0402]
C768  1uF  [SMD_0402]
C769  100nF  [SMD_0402]
C770  1uF  [SMD_0402]
C771  1uF  [SMD_0402]
C772  100nF  [SMD_0402]
C773  1uF  [SMD_0402]
C774  100nF  [SMD_0402]
C775  100nF  [SMD_0402]
C776  100nF  [SMD_0402]
C777  100nF  [SMD_0402]
C778  100nF  [SMD_0402]
C779  100nF  [SMD_0402]
D12  B340B-13-F  [smb]
L32  BLM18EG601SN1  [SMD_0603]
L33  15uH  [SMD]
L34  BLM15AG121SN1D  [SMD_0402]
L35  BLM15AG121SN1D  [SMD_0402]
L36  BLM15AG121SN1D  [SMD_0402]
L37  BLM15AG121SN1D  [SMD_0402]
L38  BLM15AG121SN1D  [SMD_0402]
L39  BLM15AG121SN1D  [SMD_0402]
L40  BLM15AG121SN1D  [SMD_0402]
L41  BLM15AG121SN1D  [SMD_0402]
L42  BLM15AG121SN1D  [SMD_0402]
L43  BLM15AG121SN1D  [SMD_0402]
Q3  BC856BLT1G  [SOT_23]
Q4  BC847ALT1G  [SOT_23]
R631  0  [SMD_0402]
R632  1M  [SMD_0402]
R633  0  [SMD_0402]
R634  0  [SMD_0402]
R635  0  [SMD_0402]
R636  10K  [SMD_0402]
R637  0  [SMD_0402]
R638  39K  [SMD_0402]
R639  100  [SMD_0402]
R640  4,7K  [SMD_0402]
R641  0  [SMD_0402]
R642  10K  [SMD_0402]
R643  4,7K  [SMD_0402]
R644  0  [SMD_0402]
R645  4,7K  [SMD_0402]
R646  20K  [SMD_0402]
R647  0  [SMD_0402]
R648  0  [SMD_0402]
R649  0  [SMD_0402]
R650  0  [SMD_0402]
R651  0  [SMD_0402]
R652  5,1K  [SMD_0402]
R653  10,7K  [SMD_0603]
R654  20K  [SMD_0402]
R655  1,21K  [SMD_0603]
R656  0  [SMD_0402]
R657  0  [SMD_0402]
R658  22  [SMD_0402]
R659  22  [SMD_0402]
R660  4,7K  [SMD_0402]
R661  4,7K  [SMD_0402]
R662  330  [SMD_0402]
R663  2K  [SMD_0402]
TP99  TEST POINT  [PCB]  (value not drawn)
TP100  TEST POINT  [PCB]  (value not drawn)
TP101  TEST POINT  [PCB]  (value not drawn)
TP102  TEST POINT  [PCB]  (value not drawn)
TP103  TEST POINT  [PCB]  (value not drawn)
TP104  TEST POINT  [PCB]  (value not drawn)
TP105  TEST POINT  [PCB]  (value not drawn)
TP106  TEST POINT  [PCB]  (value not drawn)
TP107  TEST POINT  [PCB]  (value not drawn)
TP108  TEST POINT  [PCB]  (value not drawn)
TP109  TEST POINT  [PCB]  (value not drawn)
TP110  TEST POINT  [PCB]  (value not drawn)
TP111  TEST POINT  [PCB]  (value not drawn)
TP112  TEST POINT  [PCB]  (value not drawn)
TP113  TEST POINT  [PCB]  (value not drawn)
TP114  TEST POINT  [PCB]  (value not drawn)
TP115  TEST POINT  [PCB]  (value not drawn)
TP116  TEST POINT  [PCB]  (value not drawn)
U58  CM9882A  [LQFP48]
U59  M24C32  [SOIC8]
U60  TPS5430MDDAREP  [8-SOIC]
U61  CM8828  [LQFP-80]
Y6  24,576MHz  [SMD_HC49/US]

### Blocks framed on the sheet
CRYSTAL: C745 C746 R632 Y6
EEPROM: C754 R644 U59
I2C MASTER: R660 R661 TP99 TP100

### Ports
CENTER, CODEC_DMIC_CLK, CODEC_DMIC_DATA, DWNRST4_L, FRONT-JD (out), FRONT-L (out), FRONT-R (out), LFE, LINE1VREFO (out), LINE2-JD (out), LINE2-L (out), LINE2-R (out), LINE2VREFO (out), MIC1-JD (out), MIC1-L (out), MIC1-R (out), MIC1VREF-L (out), MIC1VREF-R (out), MIC2-L (out), MIC2-R (out), MUTE (out), REFCLKN4, REFCLKP4, RXN1, RXP1, TXN1, TXP1, XGPIO0 (out), XGPIO1 (out), XHDA_BCLK (out), XHDA_RSTN (out), XHDA_SDI (out), XHDA_SDO (out), XHDA_SYNC (out)

### Nets
1V8: L40.1 L41.1
3V3: L36.1 L37.1 L38.1
5V0: L39.1
12V: C757.1 C758.1 L32.1 U60.7(VIN)
+3.3VH: C762.1 C763.2 L38.2 R656.2 U58.9(DVDD-IO)
+5VH: L39.2 R631.1 R635.1 R641.2
-12V: C756.2 C758.2 D12.ANODE R636.2 R655.2 U60.6(GND) U60.9(EP)
AGND: C744.2 C747.1 C748.2 C749.1 C750.2 C752.1 C753.2 L34.2 L35.2 R646.1 U58.26(AVSS1) U58.42(AVSS2)
DGND: C745.2 C746.2 C751.2 C754.2 C759.2 C760.1 C761.2 C762.2 C763.1 C764.1 C771.1 C772.1 C773.1 C774.1 C775.1 C776.1 C777.1 C778.1 C779.1 L34.1 L35.1 L42.2 L43.2 R642.1 R647.1 R657.2 R662.1 U58.7(DVSS) U59.1(E0) U59.2(E1) U59.3(E2) U59.4(VSS) U59.7(WC) U61.16(DGND) U61.38(DGND) U61.42(DGND) U61.63(DGND) U61.72(DGND)
DVCC: C774.2 C775.2 C776.2 C777.2 C778.2 C779.2 L37.2 R644.2 R660.2 R661.2 U61.15(DVCC) U61.30(DVCC) U61.41(DVCC) U61.49(DVCC) U61.57(DVCC) U61.68(DVCC)
GND: C756.1 C757.2 L33.2 R653.1
PHYGND: C767.1 C768.1 C769.1 C770.1 L42.1 L43.1 R663.2 U61.4(GNDRX) U61.10(GNDTX) U61.13(G_MBIAS)
PVDD18: C768.2 C769.2 C770.2 L41.2 U61.1(VDDRX) U61.7(VDDTX) U61.11(V_MBIAS)
VDD18: C771.2 C772.2 C773.2 L40.2 U61.14(VDD18) U61.17(VDD18) U61.53(VDD18)
VDD33: C767.2 L36.2 U61.18(VDD33)
DWNRST4_L: U61.28(XPERSTN) ; port DWNRST4_L
LDO-OUT: C752.2 C753.1 R637.1 R641.1 U58.38(AVDD2_/_LDO-OUT2)
RXN1: C766.1 ; port RXN1
RXP1: C765.1 ; port RXP1
TXN1: U61.3(HSIN) ; port TXN1
TXP1: U61.2(HSIP) ; port TXP1
XGPIO2: TP101.1(TP) U61.34(XGPIO2)
XGPIO3: TP103.1(TP) U61.35(XGPIO3)
XGPIO4: TP105.1(TP) U61.51(XGPIO4)
XGPIO5: TP107.1(TP) U61.52(XGPIO5)
XGPIO6: TP109.1(TP) U61.54(XGPIO6)
XGPIO7: TP102.1(TP) U61.55(XGPIO7)
XGPIO8: TP104.1(TP) U61.56(XGPIO8)
XMCU_INT: TP108.1(TP) U61.47(XMCU_INT)
XMSCL: R660.1 TP99.1(TP) U59.6(SCL) U61.59(XMSCL)
XMSDA: R661.1 TP100.1(TP) U59.5(SDA) U61.58(XMSDA)
XPWDN: TP106.1(TP) U61.50(XPWDN)
XSCI_0: C745.1 R632.1 U61.39(XSCO_0) Y6.1
XSCO_0: C746.1 R632.2 U61.40(XSCI_0) Y6.2
XSPI_CEN0: TP111.1(TP) U61.76(XSPI_CEN0)
XSPI_CEN1: TP113.1(TP) U61.77(XSPI_CEN1)
XSPI_CEN2: TP115.1(TP) U61.78(XSPI_CEN2)
XSPI_CEN3: TP116.1(TP) U61.79(XSPI_CEN3)
XSPI_CLK: TP110.1(TP) U61.73(XSPI_CLK)
XSPI_DIN: TP112.1(TP) U61.74(XSPI_DIN)
XSPI_DOUT: TP114.1(TP) U61.75(XSPI_DOUT)
NetC744_1: C744.1 R631.2 R634.2 U58.29(LDO-IN_/_LINE1-VREFO)
NetC747_2: C747.2 C748.1 R635.2 R637.2 U58.25(LDO-OUT1_/_AVDD1)
NetC749_2: C749.2 C750.1 U58.27(VREF)
NetC751_1: C751.1 R636.1 R639.2 R642.2 ; port MUTE
NetC754_1: C754.1 R644.1 U59.8(VCC)
NetC755_1: C755.1 U60.1(BOOT)
NetC755_2: C755.2 D12.CATHODE L33.1 U60.8(PH)
NetC759_1: C759.1 C760.2 R656.1 U58.1(DVDD)
NetC761_1: C761.1 U58.3(DMIC-DATA_/_REGREF)
NetC764_2: C764.2 R659.2 U58.6(BCLK)
NetC765_2: C765.2 U61.8(HSOP)
NetC766_2: C766.2 U61.9(HSON)
NetC782_1: U58.16(MIC2-L) ; port MIC2-L
NetC783_1: R648.1 ; port CENTER
NetC784_1: U58.17(MIC2-R) ; port MIC2-R
NetC785_1: R649.1 ; port LFE
NetC792_1: U58.22(MIC1-R) ; port MIC1-R
NetC793_1: U58.21(MIC1-L) ; port MIC1-L
NetC796_1: U58.36(FRONT-R) ; port FRONT-R
NetC797_1: U58.35(FRONT-L) ; port FRONT-L
NetC798_1: U58.15(LINE2-R) ; port LINE2-R
NetC799_1: U58.14(LINE2-L) ; port LINE2-L
NetL32_2: L32.2 Q3.2(E) R640.2
NetQ3_1: Q3.1(B) R640.1 R643.2
NetQ3_3: Q3.3(C) R639.1
NetQ4_1: Q4.1(B) R645.1
NetQ4_2: Q4.2(E) R647.2
NetQ4_3: Q4.3(C) R643.1
NetR465_1: U61.5(REFCLK_P) ; port REFCLKP4
NetR466_1: U61.6(REFCLK_N) ; port REFCLKN4
NetR615_1: R650.1 ; port CODEC_DMIC_DATA
NetR617_1: R651.1 ; port CODEC_DMIC_CLK
NetR633_1: R633.1 R634.1 ; port LINE1VREFO
NetR633_2: R633.2 U58.33(LINE1-VREFO_/_DCVOL)
NetR638_1: R638.1 U58.34(SenesB)
NetR638_2: R638.2 ; port LINE2-JD
NetR645_2: R645.2 U61.33(XGPIO1) ; port XGPIO1
NetR646_2: R646.2 U58.40(JDREF)
NetR648_2: R648.2 U58.43(CENTER)
NetR649_2: R649.2 U58.44(LFE)
NetR650_2: R650.2 U58.45(SIDESURR-L_/_DMIC-DATA)
NetR651_2: R651.2 U58.46(SIDESURR-R_/_DMIC-CLK)
NetR652_1: R652.1 ; port FRONT-JD
NetR652_2: R652.2 R654.2 U58.13(SenseA)
NetR653_2: R653.2 R655.1 U60.4(VSENSE)
NetR654_1: R654.1 ; port MIC1-JD
NetR657_1: R657.1 U58.4(DVSS_/_GPIO1)
NetR658_1: R658.1 U61.21(XHDA_SDI) ; port XHDA_SDI
NetR658_2: R658.2 U58.8(SDATA-IN)
NetR659_1: R659.1 U61.20(XHDA_BCLK) ; port XHDA_BCLK
NetR662_2: R662.2 U61.29(XTEST)
NetR663_1: R663.1 U61.12(IBREF)
NetR664_2: U61.32(XGPIO0) ; port XGPIO0
NetR673_2: U58.31(LINE2-VREFO) ; port LINE2VREFO
NetR682_2: U58.32(MIC1-VREFO-R) ; port MIC1VREF-R
NetR686_2: U58.28(MIC1-VREFO-L) ; port MIC1VREF-L
NetU58_5: U58.5(SDATA-OUT) U61.19(XHDA_SDO) ; port XHDA_SDO
NetU58_10: U58.10(SYNC) U61.22(XHDA_SYNC) ; port XHDA_SYNC
NetU58_11: U58.11(RESET#) U61.23(XHDA_RSTN) ; port XHDA_RSTN

Not connected (* = marked no-connect by the designer): U58 2(DMIC-CLK_/_GPIO0)* 12(BEEP)* 18(CD-L)* 19(CD-GND)* 20(CD-R)* 23(LINE1-L)* 24(LINE1-R)* 30(MIC2-VREFO)* 37(NC_/_VREFO)* 39(SURR-L)* 41(SURR-R)* 47(SPDIFI/EAPD)* 48(SPDIFO)*; U60 2(NC1)* 3(NC2)* 5(ENA)*; U61 24(XSPI_CEN7)* 25(XSPI_CEN6)* 26(XSPI_CEN5)* 27(XSPI_CEN4)* 31(XSPDIFI_0)* 36(XOSC45)* 37(XOSC49)* 43(NC)* 44(NC)* 45(NC)* 46(NC)* 48(NC)* 60(NC)* 61(NC)* 62(NC)* 64(NC)* 65(NC)* 66(NC)* 67(NC)* 69(NC)* 70(NC)* 71(NC)* 80(XSPDIFO_0)*

### Notes on the sheet
- Placed close to pin 34
- Anti-pop noise Ctrl.
- Placed close
  to pin 38
- (near U58) near to pin 25
- near to pin 27
- (near C753) Placed close
  to pin 40
- (near R654) Placed close to pin 13
- near to pin 1
- (near C763) near to pin 9
- GPIO header
- SPI Header
- Put capacitors down on the CM8888 VDD33 around
- Put capacitors down on the CM8888 PVDD18&VDD18 around
- Put capacitors down on the CM8888 DVCC around
- ACB_0001_0
- (in symbol CAP POL_Dup1) +

### Library data of the parts
*#33 = Title_block_PPC: Title: T2080PCIe; Author: MICETEK; Page Create Date: March  8, 1995; Page Title: ?; Page Modify Date: *
C744 C761 = CAP NP_Dup3: COND.CER.10uF 6,3V 10% 0805 X5R SMD; Manufacturer Part Number 1: C0805C106K9PA!A; Manufacturer 1: KEMET; Part Number: PASSIVE_207; RSM: RC0805; PCB Footprint: SMD_0805; Part Type: Capacitors\Ceramic\SMD\0805
C745 C746 = CAP NP_Dup2: COND.CER. 20PF 50V 0402 NP0 SMD; Manufacturer Part Number 1: GRM1555C1H200JZ01D; Manufacturer 1: Murata; Part Number: PASSIVE_58; RSM: RC0402; PCB Footprint: SMD_0402; Part Type: Capacitors\Ceramic\SMD\0402
C747 C749 C751 C760 C763 C769 C772 C774-C779 = CAP NP_Dup2: COND.CER. 100NF 50V 0402 X7R SMD; Manufacturer Part Number 1: CGA2B3X7R1H104M050BD; Manufacturer 1: TDK; Part Number: PASSIVE_24; RSM: RC0402; PCB Footprint: SMD_0402; Part Type: Capacitors\Ceramic\SMD\0402
C748 C750 C753 C759 C762 = CAP NP_Dup3: COND.CER.10uF 0603 25V SMD; Manufacturer Part Number 1: CL10A106MA8NRNC; Manufacturer 1: SAMSUNG; Part Number: PASSIVE_124; RSM: RC0603; PCB Footprint: SMD_0603; Part Type: Capacitors\Ceramic\SMD\0603
C752 C754 = CAP NP_Dup2: COND.CER. 100NF 50V 0402 X7R SMD; Part Number: PASSIVE_24; Manufacturer 1: TDK; Manufacturer Part Number 1: CGA2B3X7R1H104M050BD; RSM: RC0402; Part Type: Capacitors\Ceramic\SMD\0402; PCB Footprint: SMD_0402
C755 = CAP NP_Dup3: COND.CER. 100NF 50V 0402 X7R SMD; Manufacturer Part Number 1: CGA2B3X7R1H104M050BD; Manufacturer 1: TDK; Part Number: PASSIVE_24; RSM: RC0402; PCB Footprint: SMD_0402; Distributor 1: DIGKEY (445-9694-2-ND); Part Type: Capacitors\Ceramic\SMD\0402
C756 = CAP POL_Dup1: CAP TANT 220UF 16V 10% 2917; Part Number: PASSIVE_339; Manufacturer 1: KEMET; Manufacturer Part Number 1: T491D227K016ZT; RSM: TANT-D; Part Type: Capacitors\Tantalum\SMD\CASE_D; PCB Footprint: SMD_CASE_D
C757 C758 = CAP NP_Dup3: COND.CER.4,7uF 16V X5R 0603 SMD; Manufacturer Part Number 1: CL10A475KO8NNNC; Manufacturer 1: SAMSUNG; Part Number: PASSIVE_1405; RSM: RC0603; Distributor 1: DIGIKEY (445-5980-1-ND); Part Type: Capacitors\Ceramic\SMD\0603; PCB Footprint: SMD_0603
C764 = CAP NP_Dup3: COND.CER. 22PF 50V 0402 NPO 5% SMD; Part Number: PASSIVE_65; Manufacturer 1: Murata; Manufacturer Part Number 1: GRM1555C1H220JZ01; RSM: RC0402; Part Type: Capacitors\Ceramic\SMD\0402; PCB Footprint: SMD_0402
C765 C766 = CAP NP_Dup3: COND.CER. 100NF 50V 0402 X7R SMD; Part Number: PASSIVE_24; Manufacturer 1: TDK; Manufacturer Part Number 1: CGA2B3X7R1H104M050BD; RSM: RC0402; Part Type: Capacitors\Ceramic\SMD\0402; PCB Footprint: SMD_0402
C767 C768 C770 C771 C773 = CAP NP_Dup2: CAP CER 1UF 10V 10% X5R 0402; Manufacturer Part Number 1: GRM155R61A105KE15D; Manufacturer 1: Murata; Part Number: PASSIVE_50; RSM: RC0402; PCB Footprint: SMD_0402; Part Type: Capacitors\Ceramic\SMD\0402
D12 = diode_schottky: DIODE SCHOTTKY 40V 3A SMB; Manufacturer 1: DIODES; Part Number: DISCRETE_78; RSM: SMB-AK; PCB Footprint: smb; Distributor 1: DIGIKEY(B340B-FDIDKR-ND); Manufacturer Part Number 1: B340B-13-F; Part Type: Diodes\SCHOTTKY
L32 = FERRITE_BEAD: FERRITE BEAD 600ohm 500mA 0603 SMD; Part Number: PASSIVE_377; Manufacturer 1: Murata; Manufacturer Part Number 1: BLM18EG601SN1 SMD; RSM: RC0603; Part Type: Ferrite Beads\SMD\0603; PCB Footprint: SMD_0603
L33 = INDUCTOR_Dup1: INDUCTOR POWER .68UH 17A SMD 6.90mm x 6.90mm; Part Number: PASSIVE_434; Manufacturer 1: WURTH; Manufacturer Part Number 1: 744311068; RSM: IND-WE-744311068; Part Type: Inductors\SMD; Distributor 1: DIGIKEY(732-1149-1-ND); PCB Footprint: SMD
L34-L38 = FERRITE_BEAD: FERRITE CHIP 120 OHM 500MA 0402; Part Number: PASSIVE_370; Manufacturer 1: Murata; RSM: RC0402; Part Type: Ferrite Beads\SMD\0402; Manufacturer Part Number 1: BLM15AG121SN1D; Distributor 1: DIGIKEY (490-1005-2-ND); PCB Footprint: SMD_0402
L39-L43 = FERRITE_BEAD: FERRITE CHIP 120 OHM 500MA 0402; Manufacturer 1: Murata; Part Number: PASSIVE_370; RSM: RC0402; PCB Footprint: SMD_0402; Distributor 1: DIGIKEY (490-1005-2-ND); Manufacturer Part Number 1: BLM15AG121SN1D; Part Type: Ferrite Beads\SMD\0402
Q3 = PNP BEC: TRANS PNP 65V 0.1A SOT23; Part Number: DISCRETE_260; Manufacturer 1: ON SEMICONDUCTOR; RSM: SOT-23; Part Type: Transistors\Bipolar\PNP; Manufacturer Part Number 1: BC856BLT1G; Distributor 1: DIGIKEY(BC856BLT1GOSCT-ND); PCB Footprint: SOT_23
Q4 = NPN BEC: TRANS NPN 45V 0.1A SOT23; Part Number: DISCRETE_258; Manufacturer 1: ON Semi; RSM: SOT-23; Part Type: Transistors\Bipolar\NPN; Manufacturer Part Number 1: BC847ALT1G; Distributor 1: DIGIKEY (BC847ALT1GOSCT-ND); PCB Footprint: SOT_23
R631 R633 R637 R644 = R_Dup3: RESIS.CHIP 0R 5% 0402 SMD; Manufacturer 1: ROYAL OHM; Part Number: PASSIVE_805; RSM: RC0402; Manufacturer Part Number 1: RESIS.CHIP 0R 5% 0402 SMD; Part Type: Resistors\Fixed\SMD\0402\5%; PCB Footprint: SMD_0402
R632 = R_Dup4: RESIS.CHIP 1M 1% 0402 SMD; Manufacturer Part Number 1: RESIS.1M 1% 0402 SMD; Manufacturer 1: ROYAL OHM; Part Number: PASSIVE_630; RSM: RC0402; PCB Footprint: SMD_0402; Part Type: Resistors\Fixed\SMD\0402\1%
R634 R635 R641 R647 R656 R657 = R_Dup3: RESIS.CHIP 0R 5% 0402 SMD; Part Number: PASSIVE_805; Manufacturer 1: ROYAL OHM; RSM: RC0402; Part Type: Resistors\Fixed\SMD\0402\5%; PCB Footprint: SMD_0402; Manufacturer Part Number 1: RESIS.CHIP 0R 5% 0402 SMD
R636 = R_Dup6: RESIS.CHIP 10K 1% 0402 SMD; Manufacturer 1: ROYAL OHM; Part Number: PASSIVE_584; RSM: RC0402; Manufacturer Part Number 1: RESIS.CHIP 10K 1% 0402 SMD; PCB Footprint: SMD_0402; Part Type: Resistors\Fixed\SMD\0402\1%
R638 = R_Dup3: RESIS.CHIP 39K 1% 0402 SMD; Part Number: PASSIVE_714; Manufacturer 1: bourns; Manufacturer Part Number 1: CR0402-FX-3902GLF; RSM: RC0402; Part Type: Resistors\Fixed\SMD\0402\1%; PCB Footprint: SMD_0402
R639 = R_Dup6: as R608 on sheet 22 MXM_VIDEO_OUT; Manufacturer Part Number 1: RESIS.CHIP 100R 5% 0402 SMD; PCB Footprint: SMD_0402; Part Type: Resistors\Fixed\SMD\0402\5%
R640 R643 R645 R660 R661 = R_Dup3: RES 4.7K OHM 1/10W 1% 0402 SMD; Part Number: PASSIVE_718; Manufacturer 1: PANASONIC; Manufacturer Part Number 1: ERJ-2RKF4701X; RSM: RC0402; Part Type: Resistors\Fixed\SMD\0402\1%; PCB Footprint: SMD_0402
R642 = R_Dup6: RESIS.CHIP 10K 1% 0402 SMD; Part Number: PASSIVE_584; Manufacturer 1: ROYAL OHM; RSM: RC0402; Part Type: Resistors\Fixed\SMD\0402\1%; Manufacturer Part Number 1: RESIS.CHIP 10K 1% 0402 SMD; PCB Footprint: SMD_0402
R646 R654 = R_Dup6: RESIS.CHIP 20K 1% 0402 SMD; Manufacturer Part Number 1: RC0402FR-1320KL; Manufacturer 1: YAGEO; Part Number: PASSIVE_641; RSM: RC0402; PCB Footprint: SMD_0402; Part Type: Resistors\Fixed\SMD\0402\1%
R648 R649 = R_Dup6: as R611 on sheet 22 MXM_VIDEO_OUT; PCB Footprint: SMD_0402; Distributor 1: CAMEL ELETTRONICA SRL  #; Manufacturer Part Number 1: RESIS.CHIP 0R 5% 0402 SMD; Part Type: Resistors\Fixed\SMD\0402\5%
R650 R651 = R_Dup6: as R612 on sheet 22 MXM_VIDEO_OUT; Part Type: Resistors\Fixed\SMD\0402\5%; Manufacturer Part Number 1: RESIS.CHIP 0R 5% 0402 SMD; Distributor 1: CAMEL ELETTRONICA SRL  #; PCB Footprint: SMD_0402
R652 = R_Dup3: RES SMD 5.1K OHM 1% 1/16W 0402; Part Number: PASSIVE_742; Manufacturer 1: YAGEO; Manufacturer Part Number 1: RC0402FR-075K1L; RSM: RC0402; Part Type: Resistors\Fixed\SMD\0402\1%; PCB Footprint: SMD_0402
R653 = R_Dup6: RESIS.CHIP 10,7K 1% 0603 E96; Manufacturer 1: ROYAL OHM; Part Number: PASSIVE_897; RSM: RC0603; PCB Footprint: SMD_0603; Distributor 1: CAMEL ELETTRONICA SRL  #; Manufacturer Part Number 1: RESIS.CHIP 10,7K 1% 0603 E96; Part Type: Resistors\Fixed\SMD\0603\1%
R655 = R_Dup6: RESIS.CHIP 1,21K 1% 0603 SMD; Part Number: PASSIVE_884; Manufacturer 1: ROYAL OHM; Manufacturer Part Number 1: RES.1K21 1% 0603 SMD; RSM: RC0603; PCB Footprint: SMD_0603; Part Type: Resistors\Fixed\SMD\0603\1%; Distributor 1: CAMEL ELETTRONICA SRL  #
R658 R659 = R_Dup3: RESIS.CHIP 22R 5% 0402 SMD; Manufacturer 1: ROYAL OHM; Part Number: PASSIVE_840; RSM: RC0402; Manufacturer Part Number 1: RESIS.CHIP 22R 5% 0402 SMD; PCB Footprint: SMD_0402; Part Type: Resistors\Fixed\SMD\0402\5%
R662 = R_Dup6: RESIS.CHIP 330R 5% 0402 SMD; Part Number: PASSIVE_854; Manufacturer 1: ROYAL OHM; RSM: RC0402; Part Type: Resistors\Fixed\SMD\0402\5%; PCB Footprint: SMD_0402; Manufacturer Part Number 1: RESIS.CHIP 330R 5% 0402 SMD
R663 = R_Dup2: RESIS.CHIP 2K 1% 0402 SMD; Manufacturer 1: ROYAL OHM; Part Number: PASSIVE_669; RSM: RC0402; Manufacturer Part Number 1: RESIS.CHIP 2K 1% 0402 SMD; PCB Footprint: SMD_0402; Part Type: Resistors\Fixed\SMD\0402\1%
TP99-TP116 = T POINT R: as TP97 on sheet 23 I2C WRAP; PCB Footprint: PCB; Part Type: Tpoint
U58 = CMI120_50: CODEC AUDIO CM9882A; Manufacturer 1: CMEDIA; Part Number: LOGIC_358; RSM: LQFP-48; Distributor 1: CMEDIA; Manufacturer Part Number 1: CM9882A; PCB Footprint: LQFP48; Part Type: CODEC\I2S
U59 = M24C32: EEPROM EEPROM S I2C 32k; Manufacturer Part Number 1: M24C32-WMN6TP; Manufacturer 1: ST; Part Number: MEMORIES_7; RSM: SO-8; Distributor 1: MOUSER(511-M24C32-WMN6TP); Part Type: EEPROM; PCB Footprint: SOIC8
U60 = TPS5430: IC REG BUCK ADJ 3A 8SOPWRPAD HiRel; Part Number: LINEAR_229; Manufacturer 1: TEXAS; RSM: SO-8-EXPOSED-PAD; PCB Footprint: 8-SOIC; Part Type: Regulators\Switching; Manufacturer Part Number 1: TPS5430MDDAREP; Distributor 1: DIGIKEY (ey	296-24266-1-ND)
U61 = RM5011_16: High Performance PCI Express Audio Processor; 1ST PART FIELD: CMI8788/ CMI8787; Part Number: LOGIC_357; Manufacturer 1: CMEDIA; RSM: LQFP-80-0_4; Part Type: PCIE\PCIE_AUDIO; Manufacturer Part Number 1: CM8828; Distributor 1: CMEDIA; PCB Footprint: LQFP-80
Y6 = CRYSTAL: QUARZO 24,576MHz HC49/USM4 CL16 FUNZ.SMD; Manufacturer Part Number 1: HC49/USM4-024M5760000UR (ROHS COMPLIANT); Manufacturer 1: MEGATEC (Cod.Forn:QSXTM24576UG55LSF); Part Number: MISC_121; RSM: XC-HC49S; Distributor 1: MODULI ELETTRONICI E COMPONENTI spa; Part Type: Quartz; PCB Footprint: SMD_HC49/US

## Sheet 25 AUDIO_CONN.SchDoc
size 420 x 297 mm
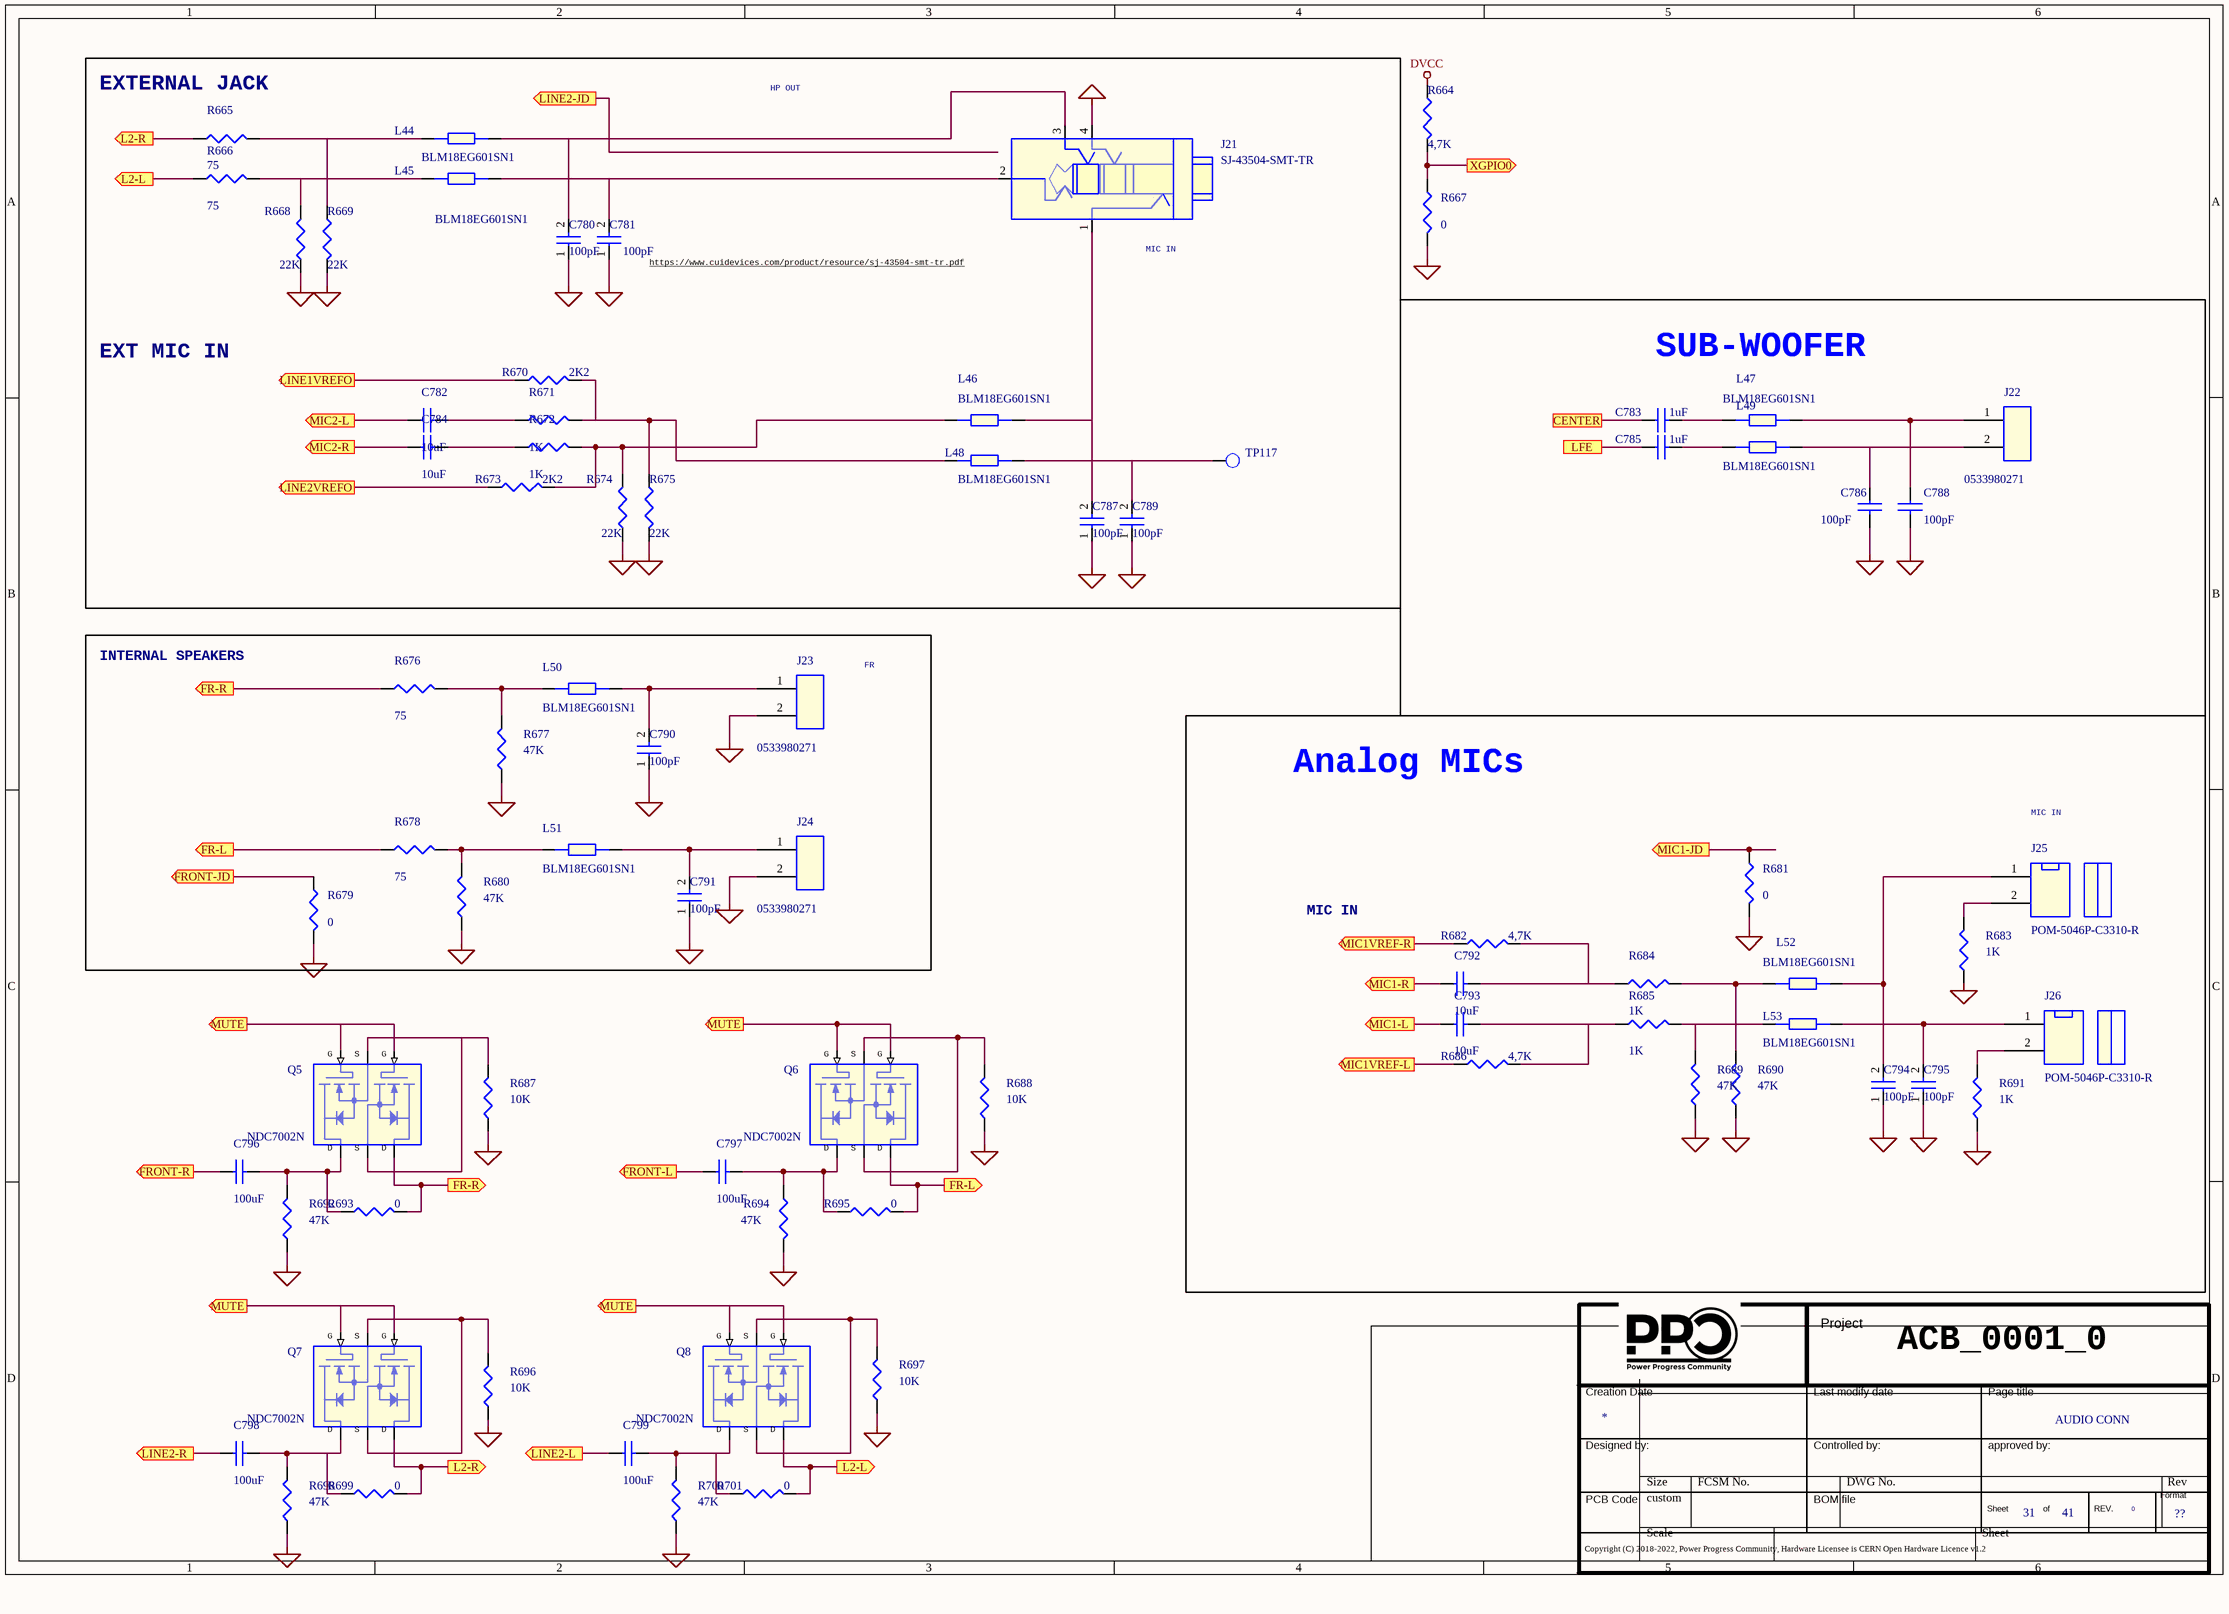
[diagram p57: 25 AUDIO_CONN.SchDoc]

### Parts
(Parts that share a designator on the sheet are numbered #1, #2 ... from top to bottom, then left to right.)
*#34  Doc: AUDIO CONN  Page Count: 41  Page Number: 31  Page Size: ??  RevCode: 0  (hidden comment: Title_block_PPC)  (graphical)
C780  100pF  [SMD_0402]
C781  100pF  [SMD_0402]
C782  10uF  [SMD_0603]
C783  1uF  [SMD_0402]
C784  10uF  [SMD_0603]
C785  1uF  [SMD_0402]
C786  100pF  [SMD_0402]
C787  100pF  [SMD_0402]
C788  100pF  [SMD_0402]
C789  100pF  [SMD_0402]
C790  100pF  [SMD_0402]
C791  100pF  [SMD_0402]
C792  10uF  [SMD_0603]
C793  10uF  [SMD_0603]
C794  100pF  [SMD_0402]
C795  100pF  [SMD_0402]
C796  100uF  [SMD_1210]
C797  100uF  [SMD_1210]
C798  100uF  [SMD_1210]
C799  100uF  [SMD_1210]
J21  SJ-43504-SMT-TR  [SMT]
J22  0533980271  [2P SMD]
J23  0533980271  [2P SMD]
J24  0533980271  [2P SMD]
J25  POM-5046P-C3310-R  [SMD_2X50_P=0.635mm]
J26  POM-5046P-C3310-R  [SMD_2X50_P=0.635mm]
L44  BLM18EG601SN1  [SMD_0603]
L45  BLM18EG601SN1  [SMD_0603]
L46  BLM18EG601SN1  [SMD_0603]
L47  BLM18EG601SN1  [SMD_0603]
L48  BLM18EG601SN1  [SMD_0603]
L49  BLM18EG601SN1  [SMD_0603]
L50  BLM18EG601SN1  [SMD_0603]
L51  BLM18EG601SN1  [SMD_0603]
L52  BLM18EG601SN1  [SMD_0603]
L53  BLM18EG601SN1  [SMD_0603]
Q5  NDC7002N  [SSOT_6]
Q6  NDC7002N  [SSOT_6]
Q7  NDC7002N  [SSOT_6]
Q8  NDC7002N  [SSOT_6]
R664  4,7K  [SMD_0402]
R665  75  [SMD_0402]
R666  75  [SMD_0402]
R667  0  [SMD_0402]
R668  22K  [SMD_0402]
R669  22K  [SMD_0402]
R670  2K2  [SMD_0402]
R671  1K  [SMD_0402]
R672  1K  [SMD_0402]
R673  2K2  [SMD_0402]
R674  22K  [SMD_0402]
R675  22K  [SMD_0402]
R676  75  [SMD_0402]
R677  47K  [SMD_0402]
R678  75  [SMD_0402]
R679  0  [SMD_0402]
R680  47K  [SMD_0402]
R681  0  [SMD_0402]
R682  4,7K  [SMD_0402]
R683  1K  [SMD_0402]
R684  1K  [SMD_0402]
R685  1K  [SMD_0402]
R686  4,7K  [SMD_0402]
R687  10K  [SMD_0402]
R688  10K  [SMD_0402]
R689  47K  [SMD_0402]
R690  47K  [SMD_0402]
R691  1K  [SMD_0402]
R692  47K  [SMD_0402]
R693  0  [SMD_0402]
R694  47K  [SMD_0402]
R695  0  [SMD_0402]
R696  10K  [SMD_0402]
R697  10K  [SMD_0402]
R698  47K  [SMD_0402]
R699  0  [SMD_0402]
R700  47K  [SMD_0402]
R701  0  [SMD_0402]
TP117  TEST POINT  [PCB]  (value not drawn)

### Blocks framed on the sheet
SUB-WOOFER: C783 C785 C786 C788 J22 L47 L49
INTERNAL SPEAKERS: C790 C791 J23 J24 L50 L51 R676-R680
Analog MICs: C792-C795 J25 J26 L52 L53 R681-R686 R689-R691

### Ports
CENTER, FR-L (out), FR-R (out), FRONT-JD (out), FRONT-L (out), FRONT-R (out), L2-L (out), L2-R (out), LFE, LINE1VREFO (out), LINE2-JD (out), LINE2-L (out), LINE2-R (out), LINE2VREFO (out), MIC1-JD (out), MIC1-L (out), MIC1-R (out), MIC1VREF-L (out), MIC1VREF-R (out), MIC2-L (out), MIC2-R (out), MUTE (out), XGPIO0 (out)

### Nets
AGND: C780.1 C781.1 C786.2 C787.1 C788.2 C789.1 C790.1 C791.1 C794.1 C795.1 J21.4(GND) J23.2 J24.2 R667.2 R668.2 R669.2 R674.2 R675.2 R677.1 R679.2 R680.1 R681.2 R683.2 R687.1 R688.1 R689.1 R690.1 R691.2 R692.1 R694.1 R696.1 R697.1 R698.1 R700.1
DVCC: R664.1
NetC751_1: Q5.1(G1) Q5.3(G2) Q6.1(G1) Q6.3(G2) Q7.1(G1) Q7.3(G2) Q8.1(G1) Q8.3(G2) ; port MUTE
NetC780_2: C780.2 J21.3(R) L44.1
NetC781_2: C781.2 J21.2(L) L45.1
NetC782_1: C782.1 ; port MIC2-L
NetC782_2: C782.2 R671.2
NetC783_1: C783.1 ; port CENTER
NetC783_2: C783.2 L47.2
NetC784_1: C784.1 ; port MIC2-R
NetC784_2: C784.2 R672.2
NetC785_1: C785.1 ; port LFE
NetC785_2: C785.2 L49.2
NetC786_1: C786.1 J22.2 L49.1
NetC787_2: C787.2 J21.1(MIC) L46.1
NetC788_1: C788.1 J22.1 L47.1
NetC789_2: C789.2 L48.1 TP117.1(TP)
NetC790_2: C790.2 J23.1 L50.1
NetC791_2: C791.2 J24.1 L51.1
NetC792_1: C792.1 ; port MIC1-R
NetC792_2: C792.2 R682.1 R684.2
NetC793_1: C793.1 ; port MIC1-L
NetC793_2: C793.2 R685.2 R686.1
NetC794_2: C794.2 J25.1 L52.1
NetC795_2: C795.2 J26.1 L53.1
NetC796_1: C796.1 ; port FRONT-R
NetC796_2: C796.2 Q5.4(D2) R692.2 R693.1
NetC797_1: C797.1 ; port FRONT-L
NetC797_2: C797.2 Q6.4(D2) R694.2 R695.1
NetC798_1: C798.1 ; port LINE2-R
NetC798_2: C798.2 Q7.4(D2) R698.2 R699.1
NetC799_1: C799.1 ; port LINE2-L
NetC799_2: C799.2 Q8.4(D2) R700.2 R701.1
NetJ25_2: J25.2 R683.1
NetJ26_2: J26.2 R691.1
NetL44_2: L44.2 R665.1 R669.1
NetL45_2: L45.2 R666.1 R668.1
NetL46_2: L46.2 R672.1 R673.1 R674.1
NetL48_2: L48.2 R670.1 R671.1 R675.1
NetL50_2: L50.2 R676.1 R677.2
NetL51_2: L51.2 R678.1 R680.2
NetL52_2: L52.2 R684.1 R690.2
NetL53_2: L53.2 R685.1 R689.2
NetQ5_2: Q5.2(S2) Q5.5(S1) R687.2
NetQ5_6: Q5.6(D1) R676.2 R693.2 ; port FR-R
NetQ6_2: Q6.2(S2) Q6.5(S1) R688.2
NetQ6_6: Q6.6(D1) R678.2 R695.2 ; port FR-L
NetQ7_2: Q7.2(S2) Q7.5(S1) R696.2
NetQ7_6: Q7.6(D1) R665.2 R699.2 ; port L2-R
NetQ8_2: Q8.2(S2) Q8.5(S1) R697.2
NetQ8_6: Q8.6(D1) R666.2 R701.2 ; port L2-L
NetR633_1: R670.2 ; port LINE1VREFO
NetR652_1: R679.1 ; port FRONT-JD
NetR654_1: R681.1 ; port MIC1-JD
NetR664_2: R664.2 R667.1 ; port XGPIO0
NetR673_2: R673.2 ; port LINE2VREFO
NetR682_2: R682.2 ; port MIC1VREF-R
NetR686_2: R686.2 ; port MIC1VREF-L

### Notes on the sheet
- (near R665) EXTERNAL JACK
- HP OUT
- MIC IN
- (near C781) https://www.cuidevices.com/product/resource/sj-43504-smt-tr.pdf
- EXT MIC IN
- FR
- (near Q5) G
- (near Q5) S
- (near Q6) G
- (near Q6) S
- (near Q5) D
- (near Q6) D
- (near Q7) G
- (near Q7) S
- (near Q8) G
- (near Q8) S
- ACB_0001_0
- (near Q7) D
- (near Q8) D

### Library data of the parts
*#34 = Title_block_PPC: Title: T2080PCIe; Author: MICETEK; Page Create Date: March  8, 1995; Page Title: ?; Page Modify Date: *
C780 C781 C787 C789-C791 C794 C795 = CAP NP_Dup1: COND.CER. 100PF 50V 0402 NPO 5% SMD; Manufacturer Part Number 1: GRM1555C1H101JD01D; Manufacturer 1: Murata; Part Number: PASSIVE_26; RSM: RC0402; PCB Footprint: SMD_0402; Part Type: Capacitors\Ceramic\SMD\0402
C782 C784 C792 C793 = CAP NP_Dup3: COND.CER.10uF 0603 25V SMD; Part Number: PASSIVE_124; Manufacturer 1: SAMSUNG; Manufacturer Part Number 1: CL10A106MA8NRNC; RSM: RC0603; Part Type: Capacitors\Ceramic\SMD\0603; PCB Footprint: SMD_0603
C783 C785 = CAP NP_Dup3: CAP CER 1.0UF 6.3V 10% X5R 0402; Part Number: PASSIVE_51; Manufacturer 1: Murata; Manufacturer Part Number 1: GRM155R60J105KE19D; RSM: RC0402; PCB Footprint: SMD_0402; Part Type: Capacitors\Ceramic\SMD\0402
C786 C788 = CAP NP_Dup3: 0402 100pF 50volts C0G 5%; Manufacturer Part Number 1: GRM1555C1H101JZ01D; Manufacturer 1: Murata; Part Number: PASSIVE_27; RSM: RC0402; Part Type: Capacitors\Ceramic\SMD\0402; PCB Footprint: SMD_0402
C796-C799 = CAP NP_Dup3: CAP CER 100UF 16V 20% X5R 1210; Part Number: PASSIVE_264; Manufacturer 1: Taiyo Yuden; Manufacturer Part Number 1: EMK325ABJ107MM-T; RSM: RC1210; Part Type: Capacitors\Ceramic\SMD\1210; PCB Footprint: SMD_1210
J21 = SJ-435107_0: 3.5 PHONEJACK TRRS MID Mount; Manufacturer 1: CUI Inc; Part Number: CONNECTORS_705; RSM: CUI-SJ-43504-SMT-TR; RoHS: YES; PCB Footprint: SMT; Distributor 1: DIGIKEY(CP-43504SJCT-ND - Cut ); Manufacturer Part Number 1: SJ-43504-SMT-TR; Part Type: JACK
J22 J23 = HEADER_2: HDR 2 CKT VERTICAL  1.25MM; Part Number: CONNECTORS_273; Manufacturer 1: MOLEX; TECNO77: CN-MLX-53261-2P; RSM: MOLEX-53398-2; Part Type: PICOBLADE; Manufacturer Part Number 1: 0533980271; Distributor 1: DIGIKEY(WM7606CT-ND); PCB Footprint: 2P SMD
J24 = HEADER_2: HDR 2 CKT VERTICAL  1.25MM; Part Number: CONNECTORS_273; Manufacturer 1: MOLEX; RSM: MOLEX-53398-2; TECNO77: CN-MLX-53261-2P; PCB Footprint: 2P SMD; Part Type: PICOBLADE; Manufacturer Part Number 1: 0533980271; Distributor 1: DIGIKEY(WM7606CT-ND)
J25 J26 = Microfono: MIC COND ANALOG OMNI -46DB 6MM D; PART NUMBER: MISC_270; Manufacturer 1: PUI AUDIO; PCB Footprint: 6X5_2 (mm); TECNO77: MICRO_POM-5246P-R; RSM: POM-5046P-C3310-R; Part Type: microphone; Manufacturer Part Number 1: POM-5046P-C3310-R; Distributor 1: DIGIKEY(668-1677-ND)
L44 L48 L50 L51 L53 = FERRITE_BEAD: FERRITE BEAD 600ohm 500mA 0603 SMD; Manufacturer Part Number 1: BLM18EG601SN1 SMD; Manufacturer 1: Murata; Part Number: PASSIVE_377; RSM: RC0603; Part Type: Ferrite Beads\SMD\0603; PCB Footprint: SMD_0603
L45-L47 L49 L52 = FERRITE_BEAD: as L32 on sheet 24 AUDIO CMEDIA; Part Type: Ferrite Beads\SMD\0603; PCB Footprint: SMD_0603
Q5 Q6 Q8 = MTD4P05_2: MOSFET 2N-CH 50V 0.51A SSOT6; Manufacturer 1: ON Semi; Part Number: DISCRETE_322; RSM: SSOT-6; PCB Footprint: SSOT_6; Distributor 1: DIGIKEY (NDC7002NCT-ND); Manufacturer Part Number 1: NDC7002N; Part Type: Mosfet\SOT23
Q7 = MTD4P05_2: MOSFET 2N-CH 50V 0.51A SSOT6; Part Number: DISCRETE_322; Manufacturer 1: ON Semi; RSM: SSOT-6; PCB Footprint: SSOT_6; Part Type: Mosfet\SOT23; Manufacturer Part Number 1: NDC7002N; Distributor 1: DIGIKEY (NDC7002NCT-ND)
R664 R682 R686 = R_Dup3: RES 4.7K OHM 1/10W 1% 0402 SMD; Manufacturer Part Number 1: ERJ-2RKF4701X; Manufacturer 1: PANASONIC; Part Number: PASSIVE_718; RSM: RC0402; PCB Footprint: SMD_0402; Part Type: Resistors\Fixed\SMD\0402\1%
R665 R666 R676 R678 = R_Dup6: RESIS.CHIP 75R 1% 0402 SMD; Manufacturer Part Number 1: RMC1/16SK75R0FTH; Manufacturer 1: KAMAYA; Part Number: PASSIVE_783; RSM: RC0402; PCB Footprint: SMD_0402; Part Type: Resistors\Fixed\SMD\0402\1%
R667 R679 R681 = R_Dup6: as R612 on sheet 22 MXM_VIDEO_OUT; PCB Footprint: SMD_0402; Part Type: Resistors\Fixed\SMD\0402\5%; Manufacturer Part Number 1: RESIS.CHIP 0R 5% 0402 SMD; Distributor 1: CAMEL ELETTRONICA SRL  #
R668 R669 R674 R675 = R_Dup3: RESIS.CHIP 22K 5% 0402 SMD; Part Number: PASSIVE_843; Manufacturer 1: ROYAL OHM; RSM: RC0402; Part Type: Resistors\Fixed\SMD\0402\5%; PCB Footprint: SMD_0402; Manufacturer Part Number 1: RESIS.CHIP 22K 5% 0402 SMD
R670 R673 = R_Dup3: RESIS.CHIP2K2 1% 0402 SMD; Part Number: PASSIVE_1456; Manufacturer 1: YAGEO; Manufacturer Part Number 1: RT0402DRD072K2L; RSM: RC0402; Part Type: Resistors\Fixed\SMD\0402\1%; PCB Footprint: SMD_0402
R671 R672 R683-R685 R691 = R_Dup6: RESIS.CHIP 1K 1% 0402 SMD; Part Number: PASSIVE_628; Manufacturer 1: ROYAL OHM; RSM: RC0402; Part Type: Resistors\Fixed\SMD\0402\1%; PCB Footprint: SMD_0402; Manufacturer Part Number 1: RESIS.CHIP 1K 1% 0402 SMD
R677 R680 R689 R690 R692 R694 R698 R700 = R_Dup6: RESIS.CHIP 47K 1% 0402 SMD; Manufacturer 1: ROYAL OHM; Part Number: PASSIVE_737; RSM: RC0402; Manufacturer Part Number 1: RESIS.CHIP 47K 1% 0402 SMD; PCB Footprint: SMD_0402; Part Type: Resistors\Fixed\SMD\0402\1%
R687 R688 R696 R697 = R_Dup6: as R642 on sheet 24 AUDIO CMEDIA; Part Type: Resistors\Fixed\SMD\0402\1%; PCB Footprint: SMD_0402; Manufacturer Part Number 1: RESIS.CHIP 10K 1% 0402 SMD
R693 R695 R699 R701 = R_Dup1: RESIS.CHIP 0R 5% 0402 SMD; Part Number: PASSIVE_805; Manufacturer 1: ROYAL OHM; RSM: RC0402; Part Type: Resistors\Fixed\SMD\0402\5%; PCB Footprint: SMD_0402; Manufacturer Part Number 1: RESIS.CHIP 0R 5% 0402 SMD
TP117 = T POINT R: as TP97 on sheet 23 I2C WRAP; PCB Footprint: PCB; Part Type: Tpoint

## Sheet 26 Clock 1.SchDoc
size 297 x 209 mm
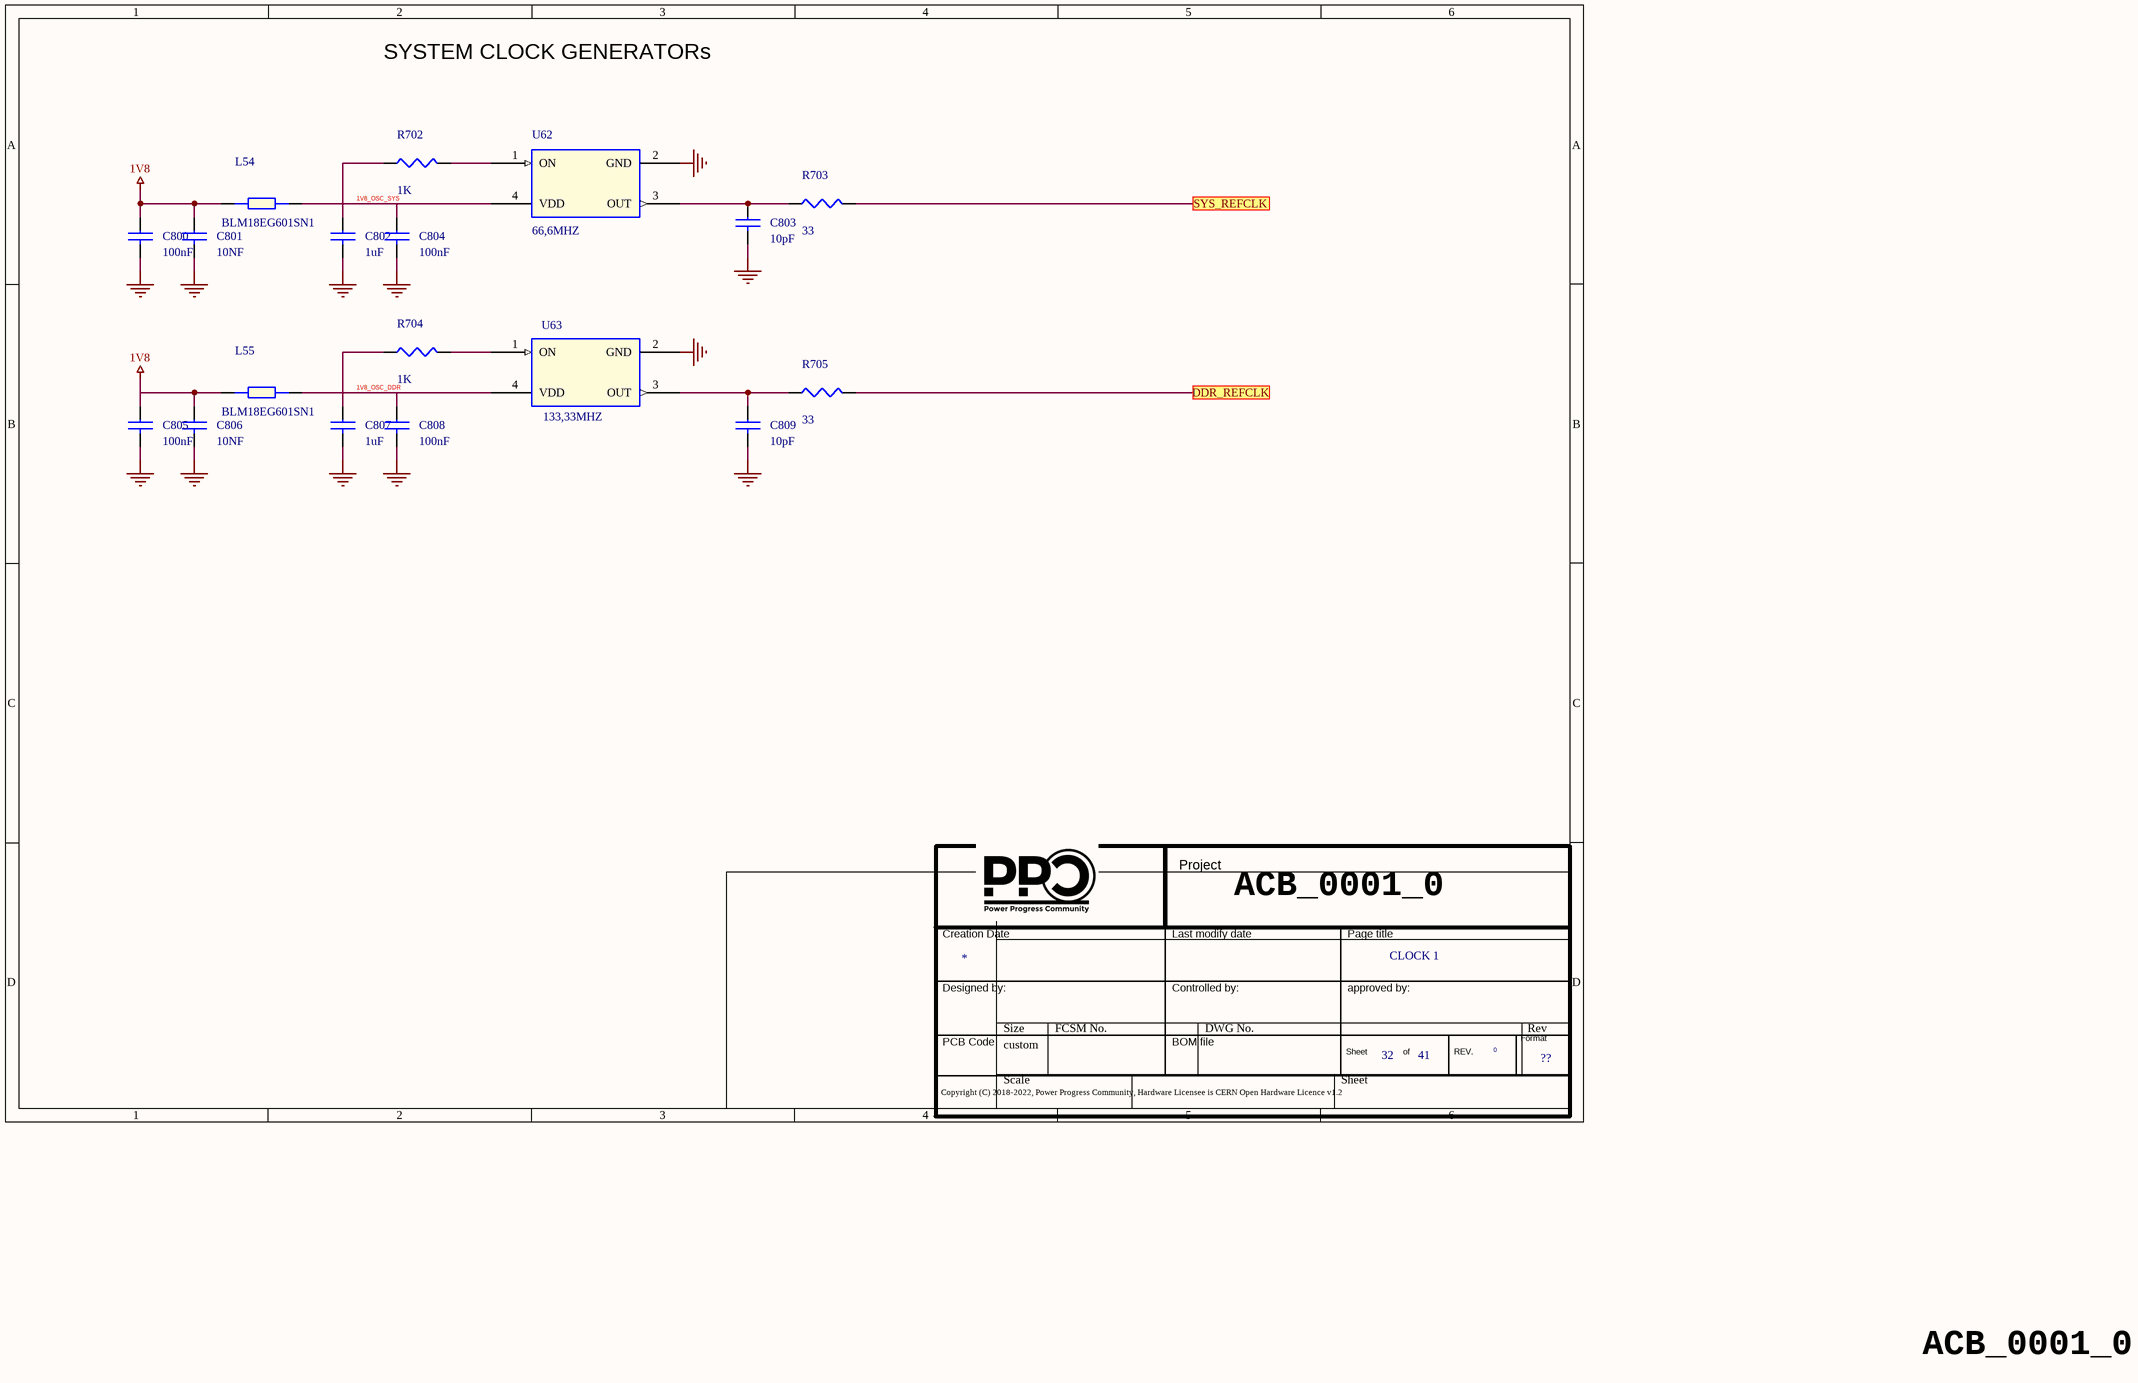
[diagram p58: 26 Clock 1.SchDoc]

### Parts
(Parts that share a designator on the sheet are numbered #1, #2 ... from top to bottom, then left to right.)
*#35  Doc: CLOCK 1  Page Count: 41  Page Number: 32  Page Size: ??  RevCode: 0  (hidden comment: Title_block_PPC)  (graphical)
C800  100nF  [SMD_0402]
C801  10NF  [SMD_0402]
C802  1uF  [SMD_0402]
C803  10pF  [SMD_0402]
C804  100nF  [SMD_0402]
C805  100nF  [SMD_0402]
C806  10NF  [SMD_0402]
C807  1uF  [SMD_0402]
C808  100nF  [SMD_0402]
C809  10pF  [SMD_0402]
L54  BLM18EG601SN1  [SMD_0603]
L55  BLM18EG601SN1  [SMD_0603]
R702  1K  [SMD_0402]
R703  33  [SMD_0402]
R704  1K  [SMD_0402]
R705  33  [SMD_0402]
U62  66,6MHZ  [4 PIN SMT]
U63  133,33MHZ  [4 PIN SMT]

### Ports
DDR_REFCLK, SYS_REFCLK

### Nets
1V8: C800.1 C801.1 C805.1 C806.1 L54.1 L55.1
GND: C800.2 C801.2 C802.2 C803.2 C804.2 C805.2 C806.2 C807.2 C808.2 C809.2 U62.2(GND) U63.2(GND)
1V8_OSC_DDR: C807.1 C808.1 L55.2 R704.1 U63.4(VDD)
1V8_OSC_SYS: C802.1 C804.1 L54.2 R702.1 U62.4(VDD)
NetC803_1: C803.1 R703.1 U62.3(OUT)
NetC809_1: C809.1 R705.1 U63.3(OUT)
NetR702_2: R702.2 U62.1(ON)
NetR703_2: R703.2 ; port SYS_REFCLK
NetR704_2: R704.2 U63.1(ON)
NetR705_2: R705.2 ; port DDR_REFCLK

### Notes on the sheet
- SYSTEM CLOCK GENERATORs
- ACB_0001_0

### Library data of the parts
*#35 = Title_block_PPC: Title: T2080PCIe; Author: MICETEK; Page Create Date: March  8, 1995; Page Title: ?; Page Modify Date: *
C800 C804 C805 C808 = CAP NP_Dup3: as C765 on sheet 24 AUDIO CMEDIA; Part Type: Capacitors\Ceramic\SMD\0402; PCB Footprint: SMD_0402
C801 C806 = CAP NP_Dup3: COND.CER. 10NF 16V 0402 X7R SMD; Part Number: PASSIVE_28; Manufacturer 1: AVX; Manufacturer Part Number 1: 0402YC103KAT2A; RSM: RC0402; Part Type: Capacitors\Ceramic\SMD\0402; PCB Footprint: SMD_0402
C802 C807 = CAP NP_Dup3: CAP CER 1UF 25V X6S 0402; Manufacturer Part Number 1: GRM155C81E105KE11D; Manufacturer 1: Murata; Part Number: PASSIVE_1446; RSM: RC0402; PCB Footprint: SMD_0402; Part Type: Capacitors\Ceramic\SMD\0402
C803 C809 = CAP NP_Dup3: COND.CER.10PF 50V 0402 NPO/COG SMD; Part Number: PASSIVE_32; Manufacturer 1: Murata; Manufacturer Part Number 1: GRM1555C1H100JZ01D; RSM: RC0402; Part Type: Capacitors\Ceramic\SMD\0402; PCB Footprint: SMD_0402
L54 L55 = FERRITE_BEAD: as L32 on sheet 24 AUDIO CMEDIA; Part Type: Ferrite Beads\SMD\0603; PCB Footprint: SMD_0603
R702 R704 = R_Dup6: as R671 on sheet 25 AUDIO_CONN; PCB Footprint: SMD_0402; Part Type: Resistors\Fixed\SMD\0402\1%; Manufacturer Part Number 1: RESIS.CHIP 1K 1% 0402 SMD
R703 = R_Dup6: RESIS.CHIP 33R 5% 0402 SMD; Part Number: PASSIVE_853; Manufacturer 1: ROYAL OHM; RSM: RC0402; PCB Footprint: SMD_0402; Part Type: Resistors\Fixed\SMD\0402\5%; Manufacturer Part Number 1: RESIS.CHIP 33R 5% 0402 SMD
R705 = R_Dup6: RESIS.CHIP 33R 5% 0402 SMD; Manufacturer 1: ROYAL OHM; Part Number: PASSIVE_853; RSM: RC0402; PCB Footprint: SMD_0402; Manufacturer Part Number 1: RESIS.CHIP 33R 5% 0402 SMD; Part Type: Resistors\Fixed\SMD\0402\5%
U62 = OSCILLATOR: MEMS OSC XO 66.6600MHZ H/LV-CMOS; Part Number: MISC_268; Manufacturer 1: SiTIME; Manufacturer Part Number 1: SIT1602BC-23-18S-66.660000D; RSM: XC-CTS-632; PCB Footprint: SMD_3.2x2.5; Part Type: Oscillator; Distributor 1: DIGIKEY(1473-SIT1602BC-23-18S-66.660000D-ND)
U63 = OSCILLATOR: MEMS OSC XO 133.3300MHZ LVCMOS; Part Number: MISC_269; Manufacturer 1: SiTIME; Manufacturer Part Number 1: SIT8009AC-12-18E-133.330000E; PCB Footprint: SMD_2.5x2.0; RSM: XC-OSC-NZ2520S; Part Type: Oscillator; Distributor 1: DIGIKEY(1473-SIT8009AC-12-18E-133.330000E-ND)